# EAGLE board 31813A (EAGLE 7.5.0)
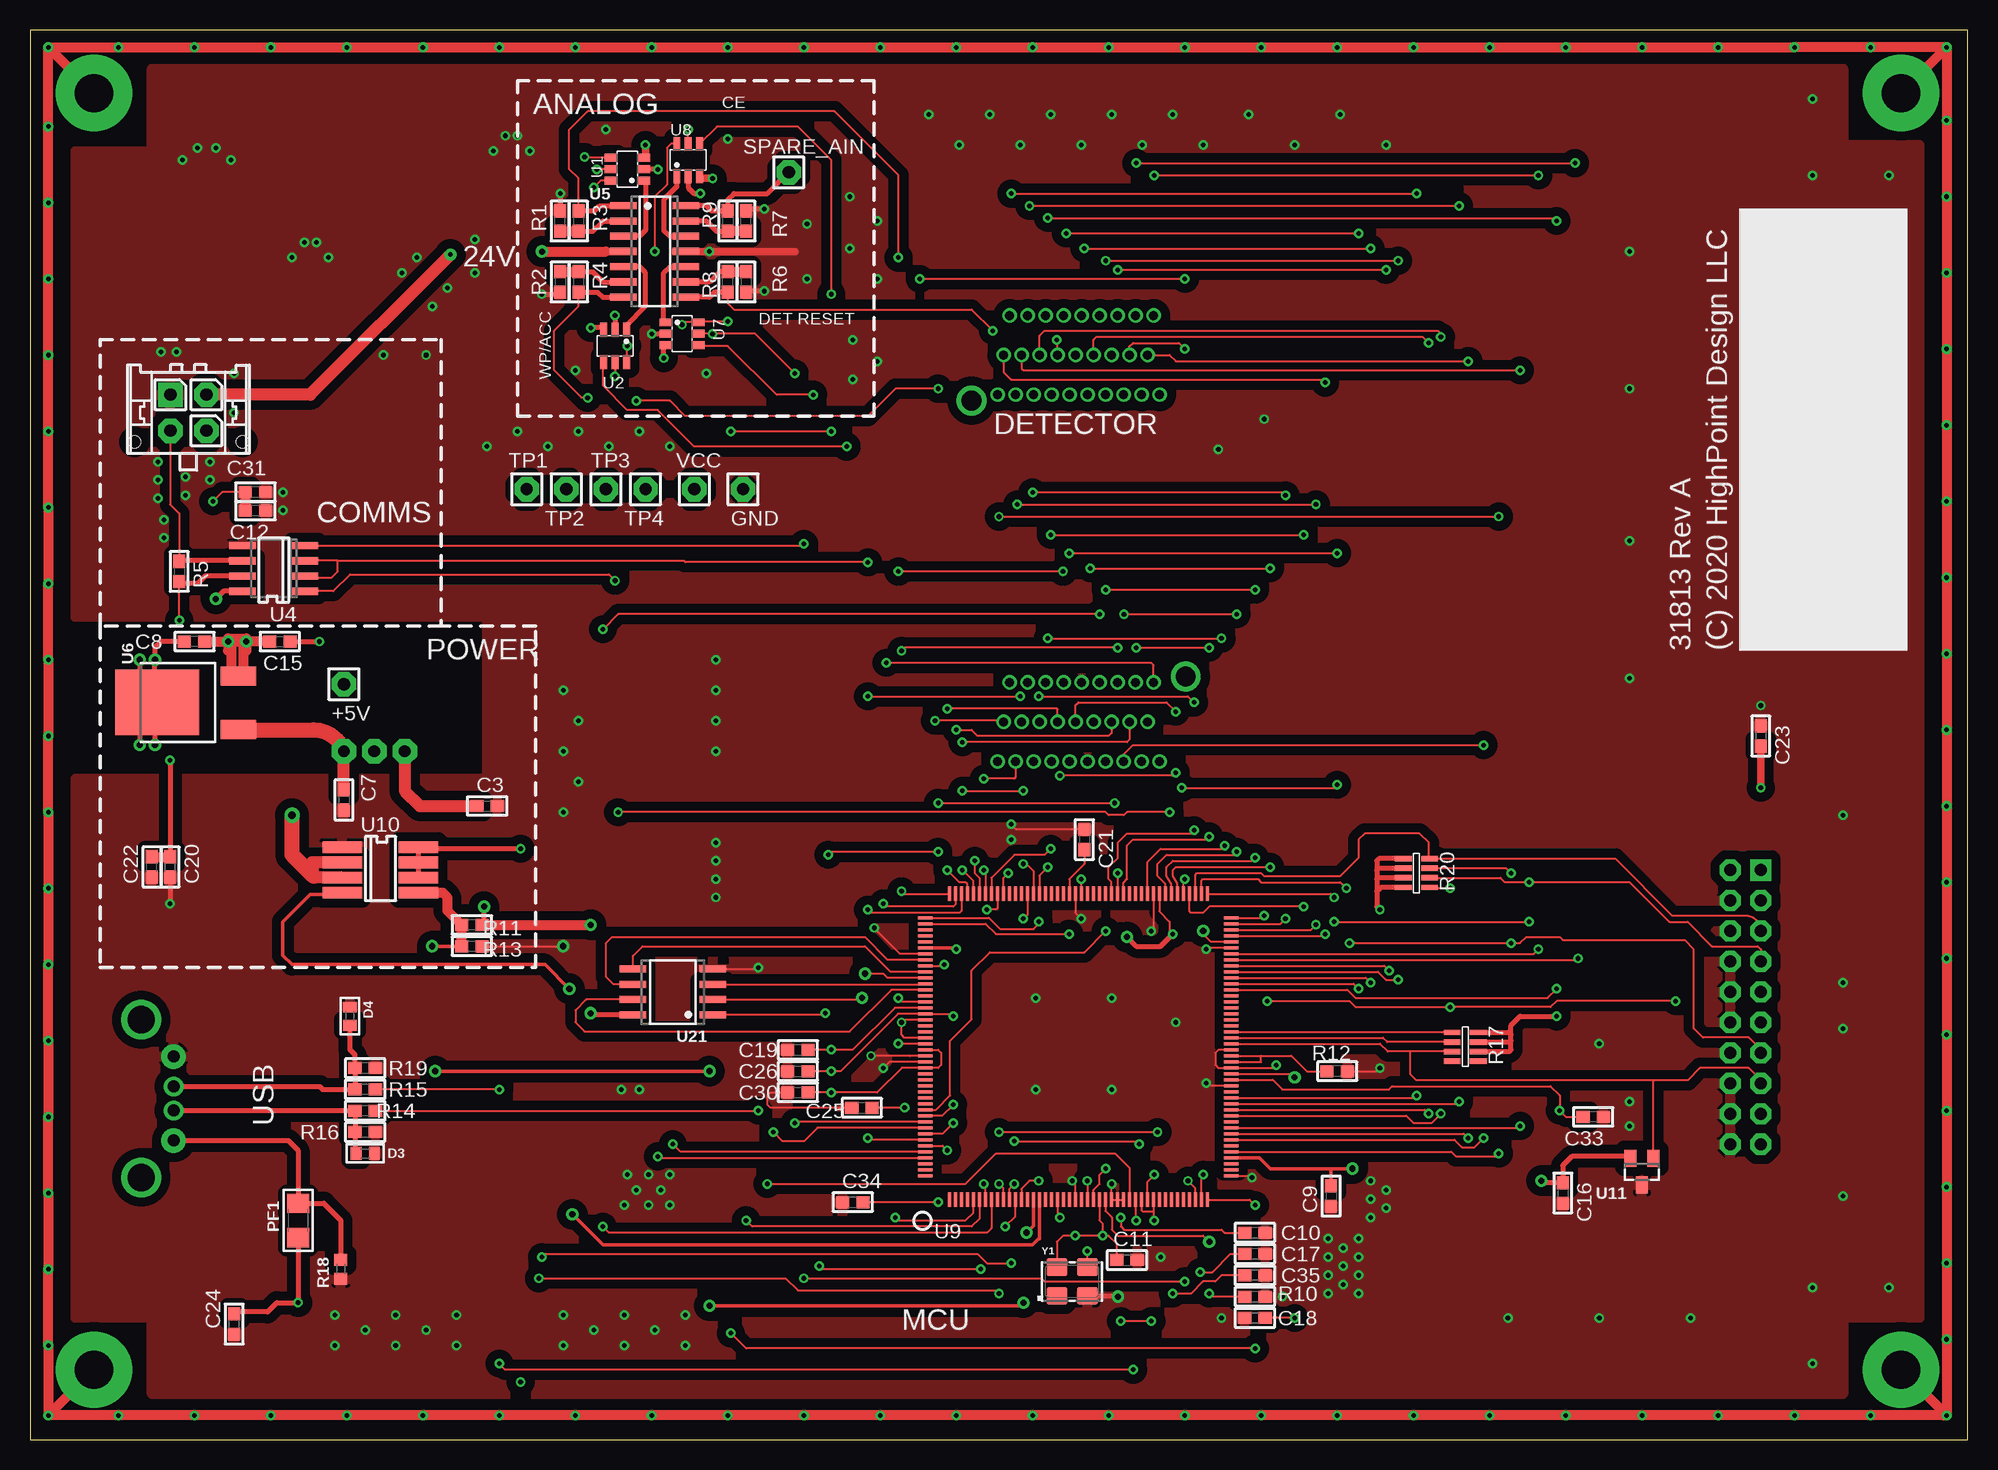
[diagram p2: board, top side]
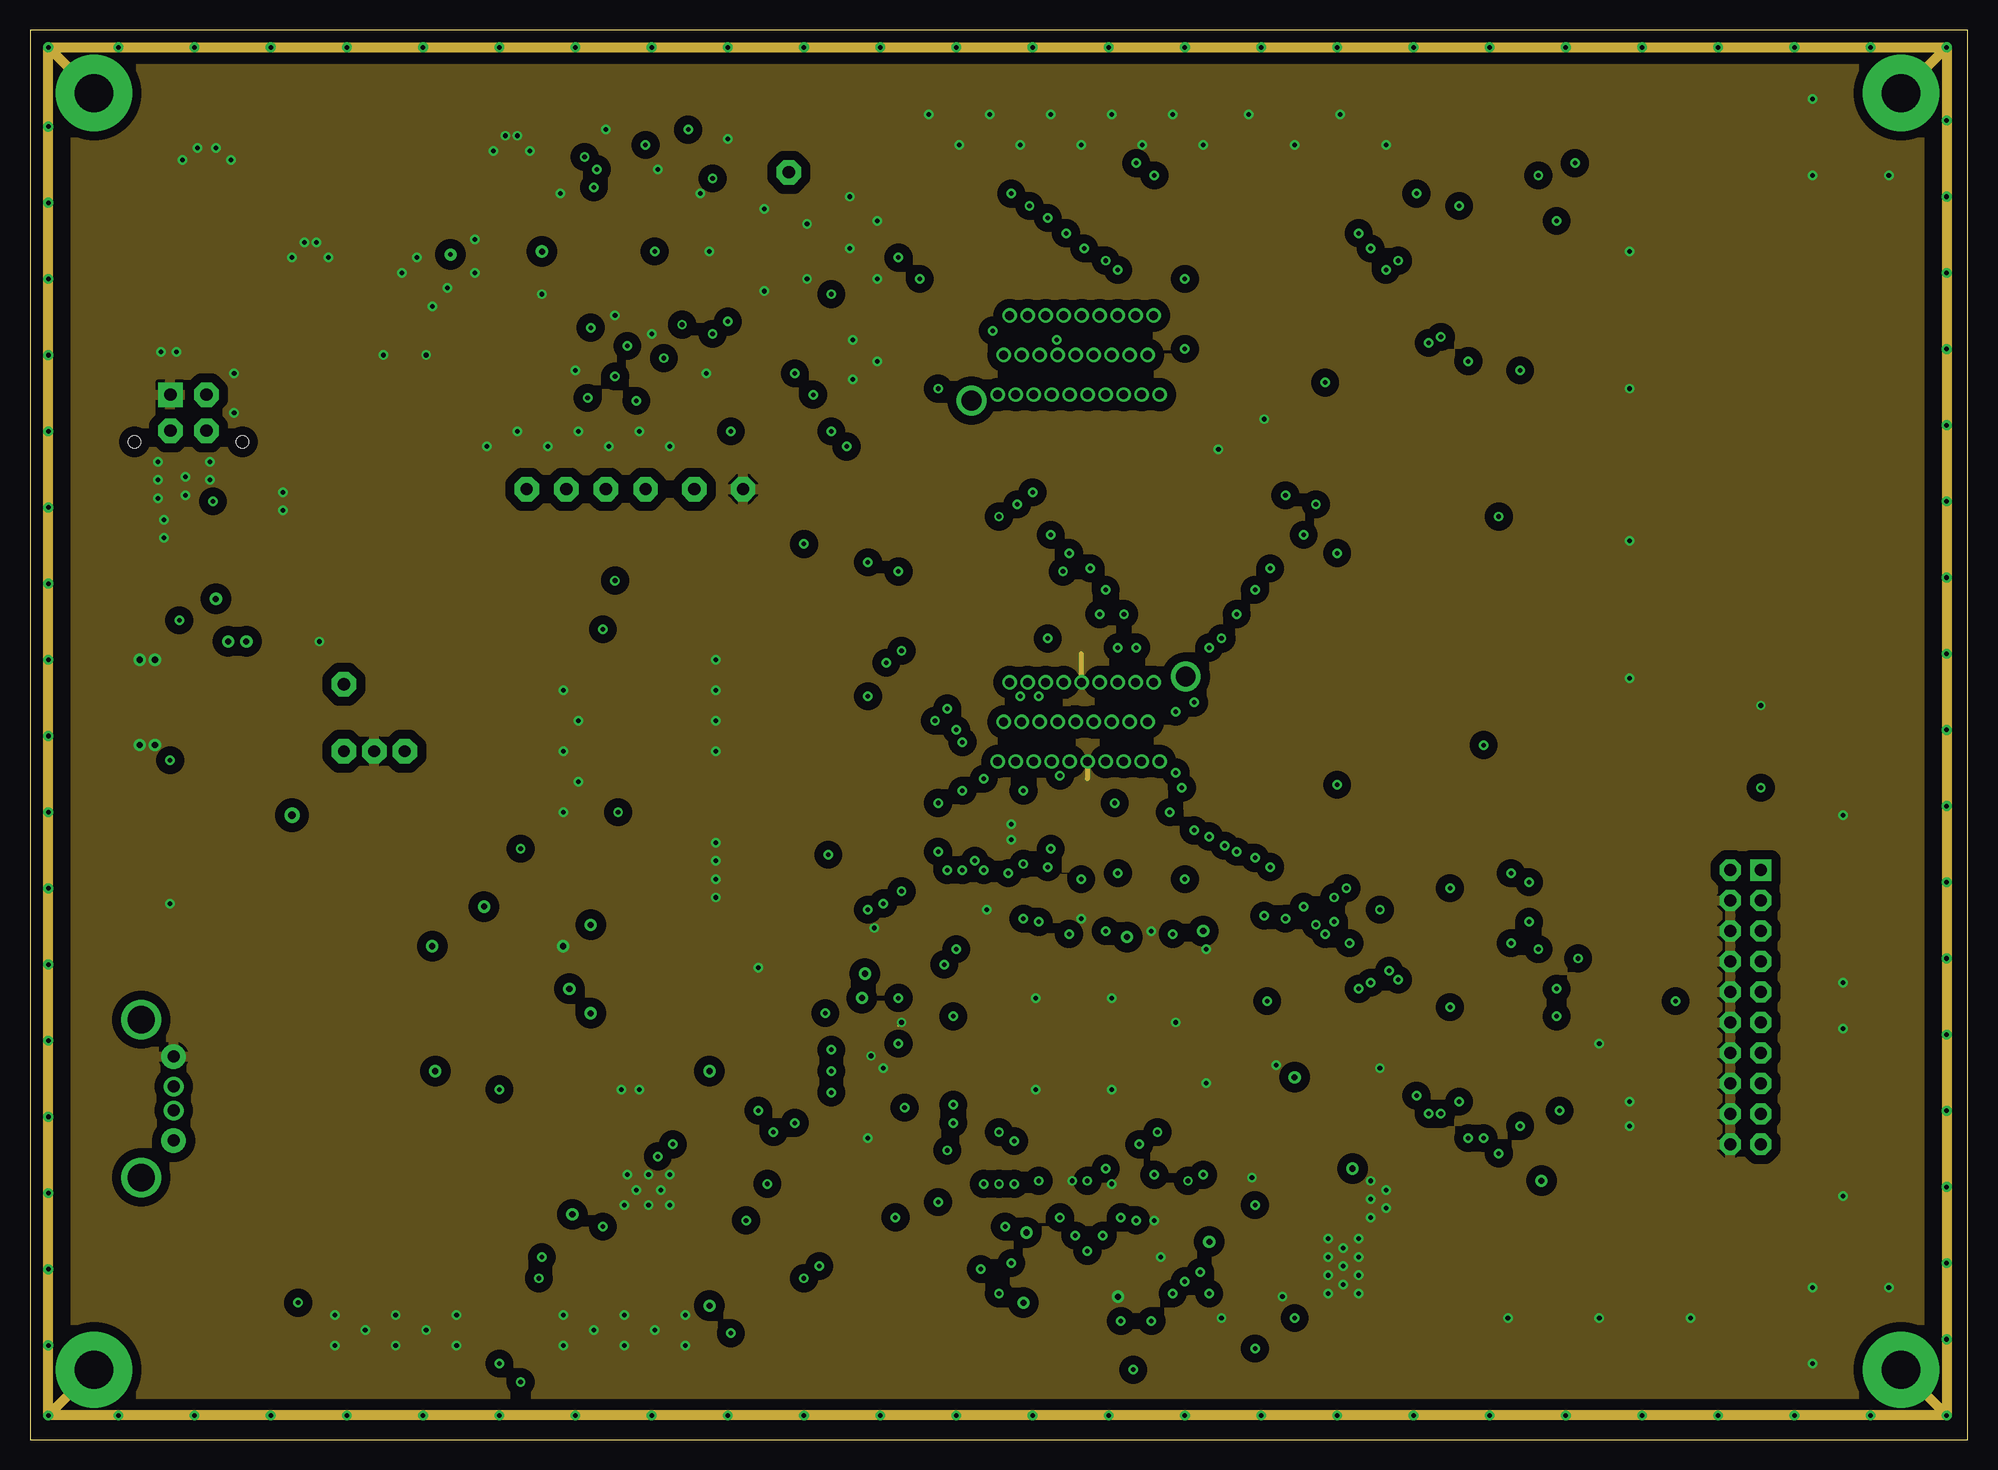
[diagram p3: board, inner layer Route2]
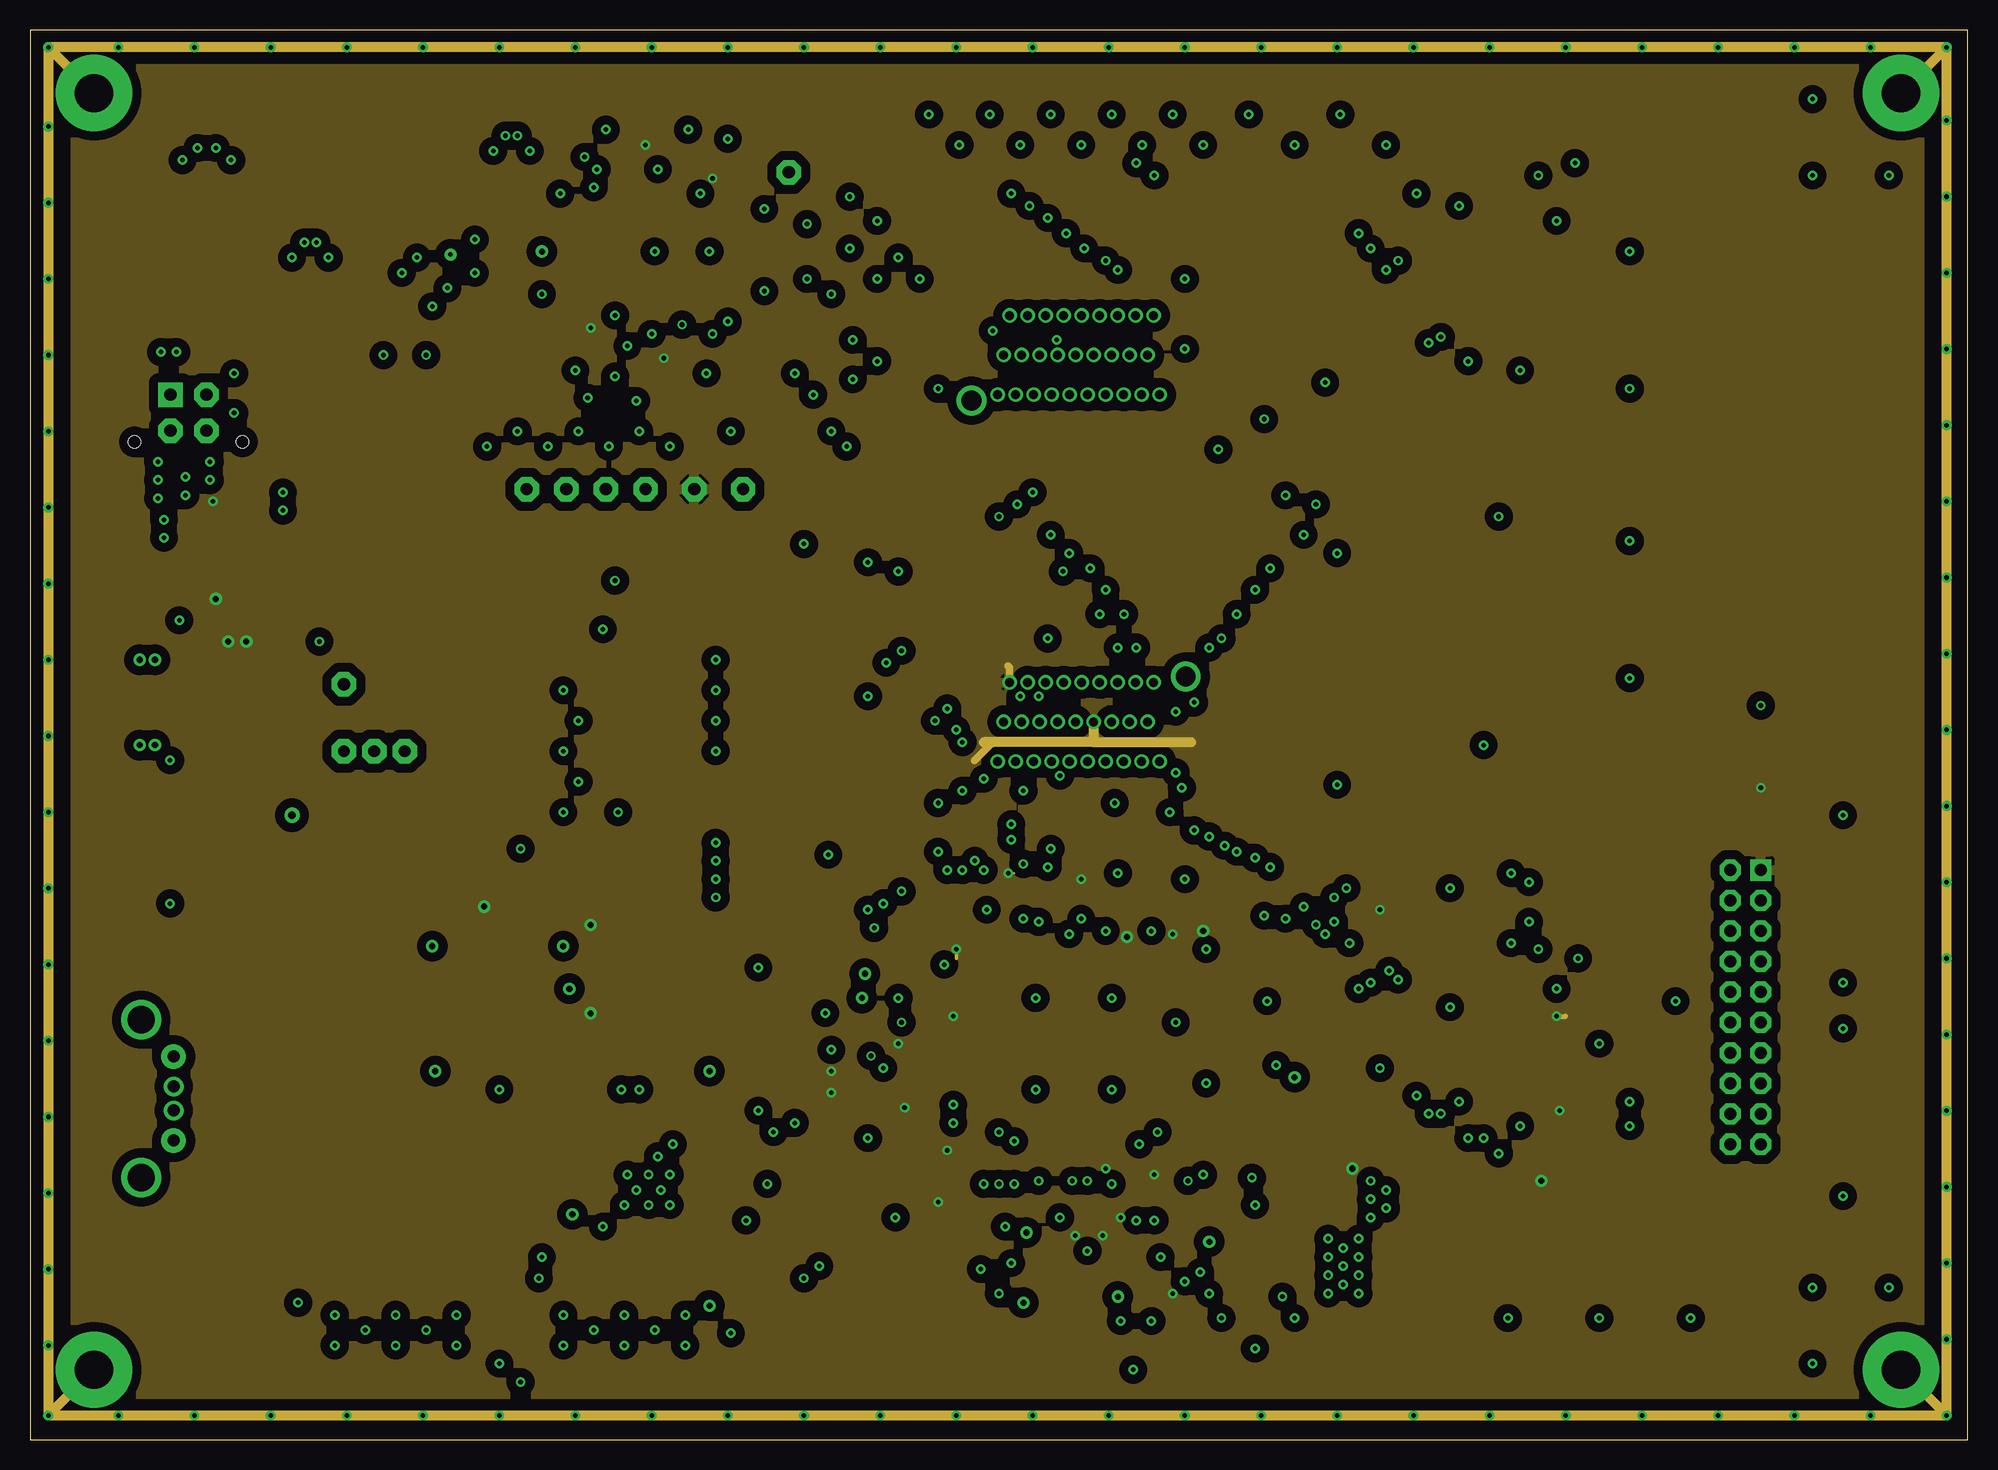
[diagram p4: board, inner layer Route15]
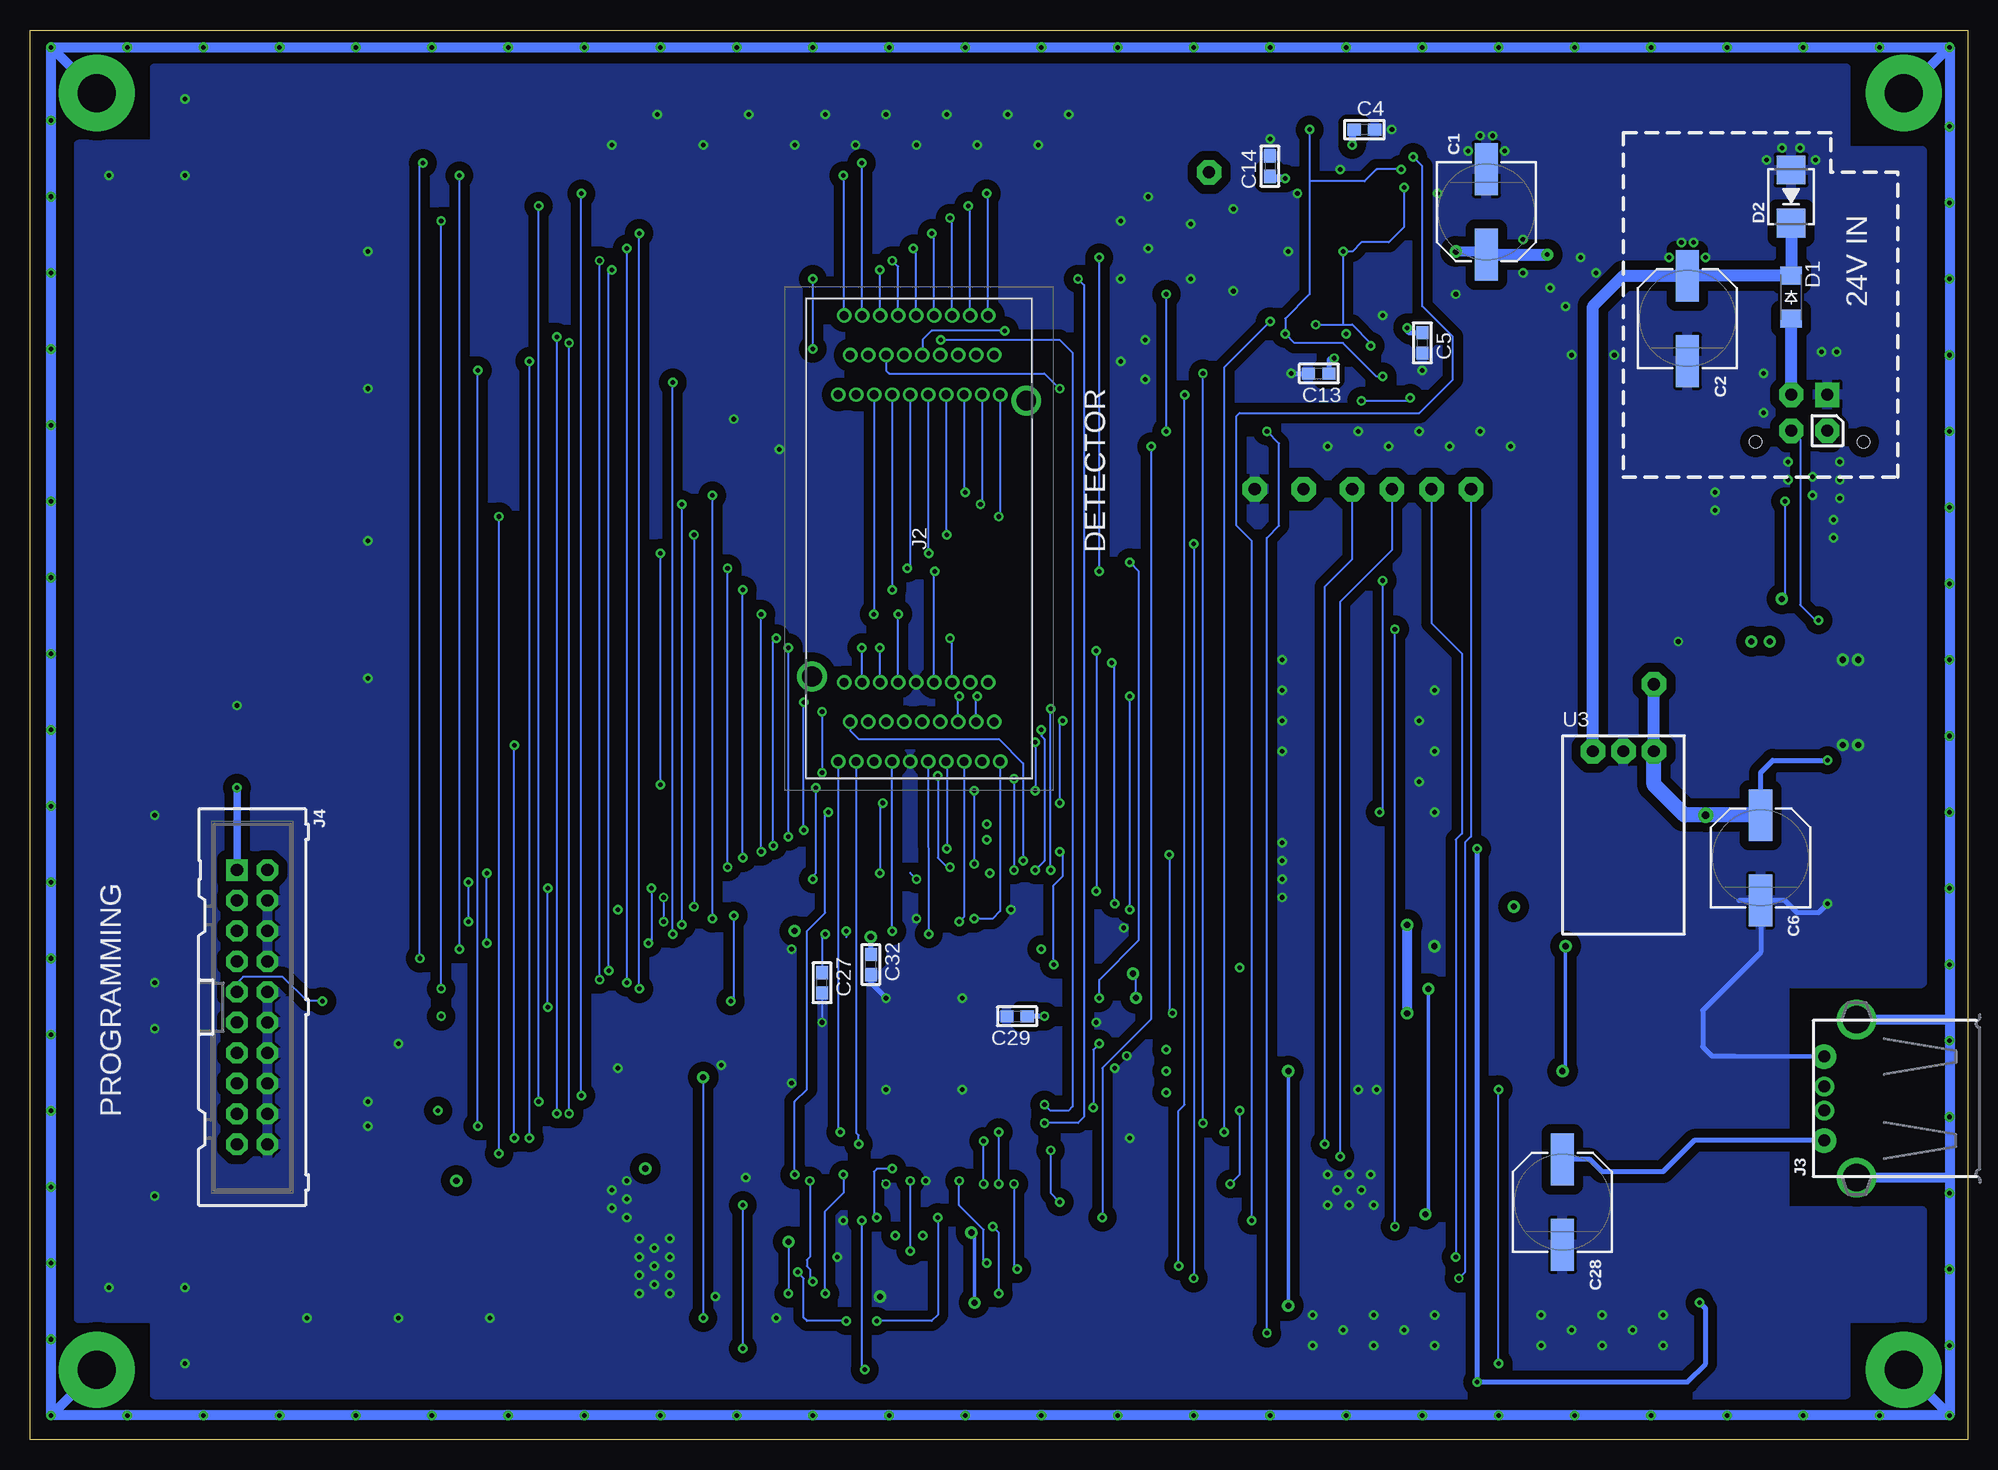
[diagram p5: board, bottom side, seen from below]

Size 161.52 x 117.53 mm. Coordinates in mm from the lower left corner, seen from the top.
Outline: 0,0 161.52,0 161.52,117.53 0,117.53 0,0
Copper layers (1*2+15*16): Top 0.035559375mm / dielectric 0.50038125mm / Route2 0.035559375mm / dielectric 0.50038125mm / Route15 0.035559375mm / dielectric 0.50038125mm / Bottom 0.035559375mm
Design rules "HPT 7X7 4 Layer": minimum track width 6mil, minimum drill 13mil, track to track 6mil, track to pad 6mil, pad to pad 6mil, via to via 6mil, smd to smd 6mil, copper to edge 24mil, drill to drill 15mil, minimum pad ring 0mil, minimum via ring 8mil, stop-mask expansion 4mil, vias tented up to drill 16mil, thermal gap 10mil

## Footprints (pad centres in the part's own frame; a part is rotated, then mirrored left to right if it is on the bottom)
TP8040 = drill 1.016 pad 2.032 octagon: 1 0,0
CSV-E/F = smd 4.318 x 1.93: + -3.556,0; - 3.556,0
0603 = smd 1.1 x 1: 1 -0.85,0; 2 0.85,0
SOD-123_MINI-SMA = smd 1.5 x 1.8: A 1.8,0; C -1.8,0
SMB = smd 2.4 x 2.4: A 2.223,0; C -2.223,0
PGB-0603 = smd 0.9 x 1.1: 1 -0.762,0; 2 0.762,0
43045-0412 = drill 1.02 pad 2.032 square: 1 1.5,0 | drill 1.02 pad 2.032 octagon: 2 -1.5,0; 3 1.5,3; 4 -1.5,3 | hole 1.02: 4.5,3.94; -4.5,3.94
IC1910562003 = drill 0.75 pad 1.2: 1 0,0; 2 0,-1.5; 3 0,-3; 4 0,-4.5; 5 0,-6; 6 0,-7.5; 7 0,-9; 8 0,-10.5; 9 0,-12; 10 3.3,0.5; 11 3.3,-1; 12 3.3,-2.5; 13 3.3,-4; 14 3.3,-5.5; 15 3.3,-7; 16 3.3,-8.5; 17 3.3,-10; 18 3.3,-11.5; 19 6.6,1; 20 6.6,-0.5; 21 6.6,-2; 22 6.6,-3.5; 23 6.6,-5; 24 6.6,-6.5; 25 6.6,-8; 26 6.6,-9.5; 27 6.6,-11; 28 6.6,-12.5; 29 30.58,0; 30 30.58,-1.5; 31 30.58,-3; 32 30.58,-4.5; 33 30.58,-6; 34 30.58,-7.5; 35 30.58,-9; 36 30.58,-10.5; 37 30.58,-12; 38 33.88,0.5; 39 33.88,-1; 40 33.88,-2.5; 41 33.88,-4; 42 33.88,-5.5; 43 33.88,-7; 44 33.88,-8.5; 45 33.88,-10; 46 33.88,-11.5; 47 37.18,1; 48 37.18,-0.5; 49 37.18,-2; 50 37.18,-3.5; 51 37.18,-5; 52 37.18,-6.5; 53 37.18,-8; 54 37.18,-9.5; 55 37.18,-11; 56 37.18,-12.5 | drill 1.65 pad 2.475: MH1 7.09,3.175; MH2 30.09,-14.675
USB = drill 1 pad 2.032: 1 -3.5,12.99; 4 3.5,12.99 | drill 1 pad 1.651: 2 -1,12.99; 3 1,12.99 | drill 2.286 pad 3.302: S1 -6.579,10.287; S2 6.579,10.287
ML20 = drill 1.016 pad 1.778 square: 1 -11.43,-1.27 | drill 1.016 pad 1.778 octagon: 2 -11.43,1.27; 3 -8.89,-1.27; 4 -8.89,1.27; 5 -6.35,-1.27; 6 -6.35,1.27; 7 -3.81,-1.27; 8 -3.81,1.27; 9 -1.27,-1.27; 10 -1.27,1.27; 11 1.27,-1.27; 12 1.27,1.27; 13 3.81,-1.27; 14 3.81,1.27; 15 6.35,-1.27; 16 6.35,1.27; 17 8.89,-1.27; 18 8.89,1.27; 19 11.43,-1.27; 20 11.43,1.27
MNT-125 = drill 3.175 pad 6.35: 1 0,0
F1206 = smd 1.6 x 1.803: 1 -1.429,0; 2 1.429,0
RNET-4R-38V = smd 0.45 x 1.4: 1 -1.2,-1.1; 2 -0.4,-1.1; 3 0.4,-1.1; 4 1.2,-1.1; 5 1.2,1.1; 6 0.4,1.1; 7 -0.4,1.1; 8 -1.2,1.1
R0603 = smd 1 x 1.1: 1 -0.794,0; 2 0.794,0
SOT23-6 = smd 0.6 x 1.1: 1 -0.95,-1.35; 2 0,-1.35; 3 0.95,-1.35; 4 0.95,1.35; 5 0,1.35; 6 -0.95,1.35
PS-OKI-78SR = drill 0.991 pad 2.032 octagon: 1 -2.54,0; 2 0,0; 3 2.54,0
SOIC-08-150 = smd 0.6 x 2.2: 1 -1.905,-2.6; 2 -0.635,-2.6; 3 0.635,-2.6; 4 1.905,-2.6; 5 1.905,2.6; 6 0.635,2.6; 7 -0.635,2.6; 8 -1.905,2.6
SO14 = smd 0.6 x 2.2: 1 -3.81,-2.6; 2 -2.54,-2.6; 3 -1.27,-2.6; 4 0,-2.6; 5 1.27,-2.6; 6 2.54,-2.6; 7 3.81,-2.6; 8 3.81,2.6; 9 2.54,2.6; 10 1.27,2.6; 11 0,2.6; 12 -1.27,2.6; 13 -2.54,2.6; 14 -3.81,2.6
DPAK = smd 1.6 x 2.997: 1 -2.261,-4.928; 3 2.21,-4.928 | smd 5.452 x 7: 4 0,1.853
LQFP176 = smd 0.25 x 1.2: 1 -10.75,-12.75; 2 -10.25,-12.75; 3 -9.75,-12.75; 4 -9.25,-12.75; 5 -8.75,-12.75; 6 -8.25,-12.75; 7 -7.75,-12.75; 8 -7.25,-12.75; 9 -6.75,-12.75; 10 -6.25,-12.75; 11 -5.75,-12.75; 12 -5.25,-12.75; 13 -4.75,-12.75; 14 -4.25,-12.75; 15 -3.75,-12.75; 16 -3.25,-12.75; 17 -2.75,-12.75; 18 -2.25,-12.75; 19 -1.75,-12.75; 20 -1.25,-12.75; 21 -0.75,-12.75; 22 -0.25,-12.75; 23 0.25,-12.75; 24 0.75,-12.75; 25 1.25,-12.75; 26 1.75,-12.75; 27 2.25,-12.75; 28 2.75,-12.75; 29 3.25,-12.75; 30 3.75,-12.75; 31 4.25,-12.75; 32 4.75,-12.75; 33 5.25,-12.75; 34 5.75,-12.75; 35 6.25,-12.75; 36 6.75,-12.75; 37 7.25,-12.75; 38 7.75,-12.75; 39 8.25,-12.75; 40 8.75,-12.75; 41 9.25,-12.75; 42 9.75,-12.75; 43 10.25,-12.75; 44 10.75,-12.75; 89 10.75,12.75; 90 10.25,12.75; 91 9.75,12.75; 92 9.25,12.75; 93 8.75,12.75; 94 8.25,12.75; 95 7.75,12.75; 96 7.25,12.75; 97 6.75,12.75; 98 6.25,12.75; 99 5.75,12.75; 100 5.25,12.75; 101 4.75,12.75; 102 4.25,12.75; 103 3.75,12.75; 104 3.25,12.75; 105 2.75,12.75; 106 2.25,12.75; 107 1.75,12.75; 108 1.25,12.75; 109 0.75,12.75; 110 0.25,12.75; 111 -0.25,12.75; 112 -0.75,12.75; 113 -1.25,12.75; 114 -1.75,12.75; 115 -2.25,12.75; 116 -2.75,12.75; 117 -3.25,12.75; 118 -3.75,12.75; 119 -4.25,12.75; 120 -4.75,12.75; 121 -5.25,12.75; 122 -5.75,12.75; 123 -6.25,12.75; 124 -6.75,12.75; 125 -7.25,12.75; 126 -7.75,12.75; 127 -8.25,12.75; 128 -8.75,12.75; 129 -9.25,12.75; 130 -9.75,12.75; 131 -10.25,12.75; 132 -10.75,12.75 | smd 1.2 x 0.25: 45 12.75,-10.75; 46 12.75,-10.25; 47 12.75,-9.75; 48 12.75,-9.25; 49 12.75,-8.75; 50 12.75,-8.25; 51 12.75,-7.75; 52 12.75,-7.25; 53 12.75,-6.75; 54 12.75,-6.25; 55 12.75,-5.75; 56 12.75,-5.25; 57 12.75,-4.75; 58 12.75,-4.25; 59 12.75,-3.75; 60 12.75,-3.25; 61 12.75,-2.75; 62 12.75,-2.25; 63 12.75,-1.75; 64 12.75,-1.25; 65 12.75,-0.75; 66 12.75,-0.25; 67 12.75,0.25; 68 12.75,0.75; 69 12.75,1.25; 70 12.75,1.75; 71 12.75,2.25; 72 12.75,2.75; 73 12.75,3.25; 74 12.75,3.75; 75 12.75,4.25; 76 12.75,4.75; 77 12.75,5.25; 78 12.75,5.75; 79 12.75,6.25; 80 12.75,6.75; 81 12.75,7.25; 82 12.75,7.75; 83 12.75,8.25; 84 12.75,8.75; 85 12.75,9.25; 86 12.75,9.75; 87 12.75,10.25; 88 12.75,10.75; 133 -12.75,10.75; 134 -12.75,10.25; 135 -12.75,9.75; 136 -12.75,9.25; 137 -12.75,8.75; 138 -12.75,8.25; 139 -12.75,7.75; 140 -12.75,7.25; 141 -12.75,6.75; 142 -12.75,6.25; 143 -12.75,5.75; 144 -12.75,5.25; 145 -12.75,4.75; 146 -12.75,4.25; 147 -12.75,3.75; 148 -12.75,3.25; 149 -12.75,2.75; 150 -12.75,2.25; 151 -12.75,1.75; 152 -12.75,1.25; 153 -12.75,0.75; 154 -12.75,0.25; 155 -12.75,-0.25; 156 -12.75,-0.75; 157 -12.75,-1.25; 158 -12.75,-1.75; 159 -12.75,-2.25; 160 -12.75,-2.75; 161 -12.75,-3.25; 162 -12.75,-3.75; 163 -12.75,-4.25; 164 -12.75,-4.75; 165 -12.75,-5.25; 166 -12.75,-5.75; 167 -12.75,-6.25; 168 -12.75,-6.75; 169 -12.75,-7.25; 170 -12.75,-7.75; 171 -12.75,-8.25; 172 -12.75,-8.75; 173 -12.75,-9.25; 174 -12.75,-9.75; 175 -12.75,-10.25; 176 -12.75,-10.75
SOIC-8-SPECIAL = smd 0.965 x 3.302: 1 -1.905,-3.175; 2 -0.635,-3.175; 3 0.635,-3.175; 4 1.905,-3.175; 5 1.905,3.175; 6 0.635,3.175; 7 -0.635,3.175; 8 -1.905,3.175
SOT23 = smd 1 x 1.4: 1 -0.95,-1.1; 2 0.95,-1.1; 3 0,1.1
SO08-JB = smd 0.6 x 2.2: 1 -1.905,-3.33; 2 -0.635,-3.33; 3 0.635,-3.33; 4 1.905,-3.33; 5 1.905,3.33; 6 0.635,3.33; 7 -0.635,3.33; 8 -1.905,3.33
ASFL1 = smd 1.7 x 1.5: 1 -1.27,-1.2; 2 1.27,-1.2; 3 1.27,1.2; 4 -1.27,1.2

## Placement (x,y rotation side)
+5V  TP  [TP8040]  26.16,62.99 0 top
C1  100 Uf  [CSV-E/F]  40.13,102.36 90 bottom
C2  100 Uf  [CSV-E/F]  23.37,93.47 270 bottom
C3  0.1 uF  [0603]  38.1,52.83 0 top
C4  10 uF  [0603]  50.29,109.22 180 bottom
C5  10 uF  [0603]  45.47,91.44 90 bottom
C6  100 Uf  [CSV-E/F]  17.27,48.51 270 bottom
C7  0.1 uF  [0603]  26.16,53.34 270 top
C8  10 uF  [0603]  13.72,66.55 180 top
C9  10 uF  [0603]  108.46,20.32 270 top
C10  10 uF  [0603]  102.11,17.27 0 top
C11  10 uF  [0603]  91.44,14.99 0 top
C12  0.1 uF  [0603]  18.8,77.47 0 top
C13  10 uF  [0603]  54.1,88.9 0 bottom
C14  10 uF  [0603]  58.17,106.17 270 bottom
C15  0.1 uF  [0603]  20.83,66.55 0 top
C16  0.1 uF  [0603]  127.76,20.57 270 top
C17  10 uF  [0603]  102.11,15.49 180 top
C18  0.1 uF  [0603]  102.11,10.16 0 top
C19  0.1 uF  [0603]  64.01,32.51 0 top
C20  10 uF  [0603]  11.68,47.75 90 top
C21  10 uF  [0603]  87.88,50.04 270 top
C22  10 uF  [0603]  10.16,47.75 90 top
C23  0.1 uF  [0603]  144.27,58.67 270 top
C24  0.1 uF  [0603]  17.02,9.65 90 top
C25  10 uF  [0603]  69.34,27.69 0 top
C26  10 uF  [0603]  64.01,30.73 0 top
C27  0.1 uF  [0603]  95.5,38.1 90 bottom
C28  100 uF  [CSV-E/F]  33.78,19.81 270 bottom
C29  10 uF  [0603]  79.25,35.31 0 bottom
C30  10 uF  [0603]  64.01,28.96 0 top
C31  0.1 uF  [0603]  18.8,78.99 180 top
C32  0.1 uF  [0603]  91.44,39.62 90 bottom
C33  10 uF  [0603]  130.3,26.92 180 top
C34  10 uF  [0603]  68.58,19.81 0 top
C35  0.1 uF  [0603]  102.11,13.72 180 top
D1  DIODE  [SOD-123_MINI-SMA]  14.73,95.25 270 bottom
D2  36 V  [SMB]  14.73,103.63 90 bottom
D3  PGB-0603  [PGB-0603]  27.94,23.88 180 top
D4  PGB-0603  [PGB-0603]  26.67,35.31 270 top
GND  TP  [TP8040]  59.44,79.25 0 top
J1  [43045-0412]  13.21,87.12 180 top
J2  IC191-0562-003  [IC1910562003]  81.66,93.73 270 bottom
J3  [USB]  -1.02,28.45 90 bottom
J4  [ML20]  143,36.07 270 bottom
M1  MNT-125  [MNT-125]  5.33,5.84 0 top
M2  MNT-125  [MNT-125]  155.96,112.27 0 top
M3  MNT-125  [MNT-125]  5.33,112.27 0 top
M4  MNT-125  [MNT-125]  155.96,5.84 0 top
PF1  0.5 A  [F1206]  22.35,18.29 90 top
R1  2.2K  [0603]  44.2,101.6 90 top
R2  2.2K  [0603]  44.2,96.52 270 top
R3  10K  [0603]  45.72,101.6 270 top
R4  10K  [0603]  45.72,96.52 270 top
R5  120  [0603]  12.45,72.39 270 top
R6  2.2K  [0603]  59.69,96.52 270 top
R7  2.2K  [0603]  59.69,101.6 90 top
R8  10K  [0603]  58.17,96.52 90 top
R9  10K  [0603]  58.17,101.6 270 top
R10  2.2 K 1%  [0603]  102.11,11.94 0 top
R11  47 K  [0603]  36.83,42.93 180 top
R12  10 K  [0603]  108.97,30.73 180 top
R13  47 K  [0603]  36.83,41.15 180 top
R14  22.1  [0603]  27.94,27.43 180 top
R15  22.1  [0603]  27.94,29.21 180 top
R16  15 K  [0603]  27.94,25.65 180 top
R17  4.7 K  [RNET-4R-38V]  119.63,32.77 90 top
R18  MOV 12V  [R0603]  25.91,14.22 270 top
R19  15 K  [0603]  27.94,30.99 180 top
R20  4.7 K  [RNET-4R-38V]  115.57,47.24 90 top
SPARE_AIN  TP  [TP8040]  63.25,105.66 0 top
TP1  TP  [TP8040]  41.4,79.25 0 top
TP2  TP  [TP8040]  44.7,79.25 0 top
TP3  TP  [TP8040]  48.01,79.25 0 top
TP4  TP  [TP8040]  51.31,79.25 0 top
U1  DAC121  [SOT23-6]  49.78,105.92 90 top
U2  DAC121  [SOT23-6]  48.77,91.19 180 top
U3  OKI-78SR-5  [PS-OKI-78SR]  28.7,57.4 0 bottom
U4  SN65HVD12D  [SOIC-08-150]  20.32,72.64 90 top
U5  TLV9304IDR  [SO14]  52.07,99.06 270 top
U6  LD29080T  [DPAK]  12.45,61.47 90 top
U7  DAC121  [SOT23-6]  54.36,92.2 270 top
U8  DAC121  [SOT23-6]  54.86,106.68 0 top
U9  S7G2  [LQFP176]  87.38,32.77 0 top
U10  TPS2051  [SOIC-8-SPECIAL]  29.21,47.5 270 top
U11  MCP120  [SOT23]  134.37,22.35 180 top
U21  W25Q128FV  [SO08-JB]  53.59,37.34 90 top
VCC  TP  [TP8040]  55.37,79.25 0 top
Y1  24.000 MHz  [ASFL1]  86.87,13.21 0 top

## Tracks (layer width: path | path; a pad name or v marks a point on that pad's centre or on a via)
+5V  (via drill 0.38, 0.64 pad 1.27)
  Top 0.406: v11.68,56.64 C20.2
  Top 0.813: C22.2 C20.2
  Top 1.016: U10.2 23.5,48.13 23.62,48.01 23.62,46.99 23.75,46.86 U10.3 | C7.1 U3.3
  Top 1.27: U6.1 17.4,59.18 23.62,59.18 arc-70 U3.3 | 23.62,46.99 21.84,48.77 v21.84,52.07
  Bottom 0.406: C6.+ 17.27,55.63 16.26,56.64 v11.68,56.64
  Bottom 1.016: U3.3 +5V.1
  Bottom 1.27: C6.+ v21.84,52.07 23.62,52.07 26.16,54.61 U3.3
+24V  (via drill 0.38 pad 1.02, 0.51 pad 1.02)
  Top 0.61: 48.01,99.06 U5.4
  Top 0.813: v42.67,99.06 48.01,99.06
  Top 1.016: v35.05,98.81 23.37,87.12 J1.2
  Bottom 0.813: C1.+ 40.39,99.06 v42.67,99.06
  Bottom 1.016: J1.2 14.73,87.15 D1.A | C1.+ v35.05,98.81
A_00  (via drill 0.38 pad 0.76)
  Top 0.178: v84.84,66.8 v99.31,66.8 | U9.99 93.13,48.17 94.23,49.28 99.31,49.28 v99.57,49.53
  Bottom 0.178: J2.31 84.66,66.63 v84.84,66.8 | v99.57,49.53 99.57,66.55 v99.31,66.8
A_01  (via drill 0.38 pad 0.76)
  Top 0.178: v91.19,68.83 v100.58,68.83 | U9.96 94.63,46.34 93.98,46.99 93.98,48.01 94.74,48.77 100.33,48.77 v100.58,49.02
  Bottom 0.178: J2.26 91.16,68.86 v91.19,68.83 | v100.58,49.02 v100.58,68.83
A_02  (via drill 0.38 pad 0.76)
  Top 0.178: v89.66,70.87 v102.11,70.87 | U9.95 95.13,46.35 94.74,46.99 94.74,47.75 95.25,48.26 101.85,48.26 v102.11,48.51
  Bottom 0.178: J2.25 v89.66,70.87 | v102.11,48.51 v102.11,70.87
A_03  (via drill 0.38 pad 0.76)
  Top 0.178: v88.39,72.64 v103.38,72.64 | U9.94 95.63,46.36 95.25,46.99 95.25,47.5 95.5,47.75 v103.38,47.75
  Bottom 0.178: J2.24 88.16,72.88 v88.39,72.64 | v103.38,47.75 v103.38,72.64
A_04  (via drill 0.38 pad 0.76)
  Top 0.178: v86.61,73.91 v108.97,73.91 | v96.01,54.36 108.71,54.36 v108.97,54.61 | U9.93 96.13,46.6 v96.27,46.74
  Bottom 0.178: J2.23 86.66,73.96 v86.61,73.91 | v96.01,54.36 96.01,47.24 96.27,46.99 v96.27,46.74 | v108.97,54.61 v108.97,73.91
A_05  (via drill 0.38 pad 0.76)
  Top 0.178: v85.09,75.44 v106.17,75.44 | v106.17,44.45 98.3,44.45 97.79,43.94 96.77,43.94 96.63,44.09 U9.92
  Bottom 0.178: J2.22 85.16,75.51 v85.09,75.44 | v106.17,75.44 v106.17,44.45
A_06  (via drill 0.38 pad 0.76)
  Top 0.178: v83.57,78.99 104.39,78.99 v104.65,78.74 | U9.87 104.23,43.02 v104.65,43.43
  Bottom 0.178: J2.21 83.66,79.09 v83.57,78.99 | v104.65,43.43 v104.65,78.74
A_07  (via drill 0.38 pad 0.76)
  Top 0.178: v82.3,77.98 v107.19,77.98 | U9.86 106.78,42.52 v107.19,42.93
  Bottom 0.178: J2.20 82.16,78.11 v82.3,77.98 | v107.19,42.93 v107.19,77.98
A_08  (via drill 0.38 pad 0.76)
  Top 0.178: J2.10 81.16,89.02 81.79,88.39 107.7,88.39 v107.95,88.14 | U9.85 107.8,42.02 v107.95,42.16
  Bottom 0.178: v107.95,42.16 v107.95,88.14
A_09  (via drill 0.38 pad 0.76)
  Top 0.178: v93.73,105.41 v125.73,105.41 | U9.82 125.35,40.52 v125.73,40.89
  Bottom 0.178: J2.9 93.66,105.34 v93.73,105.41 | v125.73,40.89 v125.73,105.41
A_10  (via drill 0.38 pad 0.76)
  Top 0.178: v92.2,106.43 v128.78,106.43 | U9.81 128.92,40.02 v129.03,40.13
  Bottom 0.178: J2.8 92.16,106.39 v92.2,106.43 | v129.03,40.13 129.03,106.17 v128.78,106.43
A_11  (via drill 0.38 pad 0.76)
  Top 0.178: v90.68,97.54 v113.03,97.54 | U9.80 112.88,39.52 v113.28,39.12
  Bottom 0.178: J2.7 90.66,97.52 v90.68,97.54 | v113.28,39.12 113.28,97.28 v113.03,97.54
A_12  (via drill 0.38 pad 0.76)
  Top 0.178: v89.66,98.3 v114.05,98.3 | U9.79 112.37,39.02 113.03,38.35 v114.05,38.35
  Bottom 0.178: J2.6 89.16,97.8 v89.66,98.3 | v114.05,38.35 v114.05,98.3
A_13  (via drill 0.38 pad 0.76)
  Top 0.178: v87.88,99.31 v111.76,99.31 | U9.78 111.34,38.52 v111.76,38.1
  Bottom 0.178: J2.5 87.66,99.09 v87.88,99.31 | v111.76,38.1 v111.76,99.31
A_14  (via drill 0.38 pad 0.76)
  Top 0.178: v86.36,100.58 v110.74,100.58 | U9.77 110.32,38.02 v110.74,37.59
  Bottom 0.178: J2.4 86.16,100.39 v86.36,100.58 | v110.74,37.59 v110.74,100.58
A_15  (via drill 0.38 pad 0.76)
  Top 0.178: v84.84,101.85 127,101.85 v127.25,101.6 | 127.18,37.52 v127.25,37.59 126.49,36.83 110.49,36.83 109.8,37.52 U9.76
  Bottom 0.178: J2.3 84.66,101.68 v84.84,101.85 | v127.25,37.59 v127.25,101.6
A_16  (via drill 0.38 pad 0.76)
  Top 0.178: J2.54 91.16,57.12 91.95,57.91 v121.16,57.91 | U9.51 118.74,25.02 119.37,24.38 120.4,24.38 v121.16,25.15
  Bottom 0.178: v121.16,25.15 v121.16,57.91
A_17  (via drill 0.38 pad 0.76)
  Top 0.178: v80.77,76.96 v122.43,76.96 | U9.49 118.48,24.02 118.87,23.62 122.17,23.62 v122.43,23.88
  Bottom 0.178: J2.19 80.66,77.07 v80.77,76.96 | v122.43,23.88 v122.43,76.96
A_18  (via drill 0.38 pad 0.76)
  Top 0.178: J2.18 94.99,90.43 95.5,89.92 v119.89,89.92 | U9.52 119.52,25.52 v119.89,25.15
  Bottom 0.178: v119.89,25.15 v119.89,89.92
A_19  (via drill 0.38 pad 0.76)
  Top 0.178: J2.11 82.66,89.3 82.8,89.15 v124.21,89.15 | U9.53 124.06,26.02 v124.21,26.16
  Bottom 0.178: v124.21,26.16 v124.21,89.15
A_20  (via drill 0.38 pad 0.76)
  Top 0.178: J2.12 84.16,92.03 84.58,92.46 117.35,92.46 117.6,92.2 v117.6,91.95 | U9.55 114.72,27.02 115.32,26.42 116.84,26.42 v117.6,27.18
  Bottom 0.178: v117.6,27.18 v117.6,91.95
A_21  (via drill 0.38 pad 0.76)
  Top 0.178: J2.15 88.66,91.71 88.9,91.95 116.08,91.95 v116.59,91.44 | U9.56 116.25,27.52 v116.59,27.18
  Bottom 0.178: v116.59,27.18 v116.59,91.44
A_22  (via drill 0.38 pad 0.76)
  Top 0.178: v83.31,102.87 v119.13,102.87 | U9.57 118.95,28.02 v119.13,28.19
  Bottom 0.178: J2.2 83.16,102.72 v83.31,102.87 | v119.13,28.19 v119.13,102.87
A_23  (via drill 0.38 pad 0.76)
  Top 0.178: v81.79,103.89 v115.57,103.89 | U9.58 115.38,28.52 v115.57,28.7
  Bottom 0.178: J2.1 81.66,103.76 v81.79,103.89 | v115.57,28.7 v115.57,103.89
A_24  (via drill 0.38, 0.38 pad 0.76)
  Top 0.178: U9.10 81.13,20.98 v80.77,21.34 | v80.77,25.65 v93.98,25.65
  Bottom 0.178: J2.56 94.16,25.84 v93.98,25.65 | v80.77,21.34 v80.77,25.65
A_25  (via drill 0.38 pad 0.76)
  Top 0.178: U9.11 81.63,20.92 v82.04,21.34 | v82.04,24.89 92.2,24.89 v92.46,24.64
  Bottom 0.178: J2.55 92.66,25.61 92.46,25.4 v92.46,24.64 | v82.04,21.34 v82.04,24.89
BYTE#  (via drill 0.38)
  Top 0.178: U9.165 75.52,27.52 76.71,28.7 76.71,33.27 78.49,35.05 78.49,39.12 80.01,40.64 87.88,40.64 v89.66,42.42
  Bottom 0.178: v89.66,42.42 J2.53
CE_AIN  (via drill 0.38 pad 0.76)
  Top 0.178: R3.1 45.72,105.16 44.96,105.92 44.96,109.22 46.48,110.74 67.06,110.74 72.39,105.41 v72.39,98.55 | v86.11,72.39 v72.39,72.39
  Top 0.406: R3.1 47.08,102.45 47.5,102.87 U5.1
  Bottom 0.178: J2.32 86.16,72.33 v86.11,72.39 | v72.39,72.39 v72.39,98.55
CE_DAC  (via drill 0.38 pad 0.76)
  Top 0.178: U9.6 79.13,18.42 78.49,17.78 60.2,17.78 v59.69,18.29 | 48.5,106.93 U1.4 48.37,106.93 v46.23,106.93
  Bottom 0.178: v59.69,18.29 59.69,74.93 60.96,76.2 60.96,85.34 60.71,85.6 45.72,85.6 42.93,88.39 42.93,91.95 45.47,94.49 45.47,106.17 v46.23,106.93
DATA_A
  Top 0.178: J1.3 11.68,84.1 11.68,77.98 12.45,77.22 R5.1
  Top 0.406: U4.6 12.48,73.28 R5.1
DATA_B  (via drill 0.38 pad 0.76)
  Top 0.178: v12.45,68.33 R5.2
  Top 0.406: U4.7 14.61,72.01 13.97,71.37 12.61,71.37 R5.2
  Bottom 0.178: J1.4 13.97,83.38 13.97,69.6 12.7,68.33 v12.45,68.33
DET_RESET_AIN  (via drill 0.38 pad 0.76)
  Top 0.178: R8.1 58.17,94.74 58.67,94.23 78.49,94.23 v80.26,92.46
  Top 0.406: R8.1 57.06,95.67 56.64,95.25 U5.8
  Bottom 0.178: v80.26,92.46 86.36,92.46 87.12,91.69 87.12,90.47 J2.14
DET_RESET_DAC  (via drill 0.38 pad 0.76)
  Top 0.178: U9.7 79.63,21.21 v79.5,21.34 | v79.25,14.22 66.04,14.22 v65.79,14.48 | v65.28,87.12 62.23,87.12 58.17,91.19 55.77,91.19 U7.4
  Bottom 0.178: v79.5,21.34 79.5,14.48 v79.25,14.22 | v65.79,14.48 65.79,27.43 65.28,27.94 v65.28,87.12
DQ_00  (via drill 0.38 pad 0.76)
  Top 0.178: v90.68,66.04 72.9,66.04 v72.64,65.79 | v72.64,45.72 72.85,45.52 U9.132
  Bottom 0.178: J2.35 90.66,66.02 v90.68,66.04 | v72.64,65.79 v72.64,45.72
DQ_01  (via drill 0.38 pad 0.76)
  Top 0.178: J2.37 93.66,64.58 93.47,64.77 v71.37,64.77 | U9.131 77.13,44.61 76.96,44.45 71.37,44.45 v71.12,44.7
  Bottom 0.178: v71.12,44.7 71.12,64.52 v71.37,64.77
DQ_02  (via drill 0.38 pad 0.76)
  Top 0.178: U9.130 77.63,44.1 77.47,43.94 70.1,43.94 v69.85,44.2 | v69.85,61.98 v82.55,61.98
  Bottom 0.178: J2.39 82.66,61.87 v82.55,61.98 | v69.85,44.2 v69.85,61.98
DQ_03  (via drill 0.38 pad 0.76)
  Top 0.178: J2.41 85.66,60.9 85.6,60.96 v76.45,60.96 | U9.129 78.13,46.33 77.98,46.48 77.47,46.48 v76.45,47.5
  Bottom 0.178: v76.45,47.5 v76.45,60.96
DQ_04  (via drill 0.38 pad 0.76)
  Top 0.178: J2.44 90.16,58.92 89.92,58.67 78.99,58.67 78.49,59.18 v77.22,59.18 | U9.128 78.63,46.6 v77.72,47.5
  Bottom 0.178: v77.22,59.18 77.22,58.67 76.96,58.42 76.96,48.26 v77.72,47.5
DQ_05  (via drill 0.38 pad 0.76)
  Top 0.178: v78.74,48.26 78.74,47.24 79.13,46.86 U9.127
  Bottom 0.178: J2.46 93.16,59.12 92.46,58.42 80.77,58.42 78.74,56.39 v78.74,48.26
DQ_06  (via drill 0.38 pad 0.76)
  Top 0.178: J2.48 82.16,55.24 82.04,55.12 v79.5,55.12 | v79.5,47.5 79.63,47.37 U9.126
  Bottom 0.178: v79.5,55.12 v79.5,47.5
DQ_07  (via drill 0.38 pad 0.76)
  Top 0.178: v85.09,49.28 84.58,48.77 82.04,48.77 80.13,46.85 U9.125
  Bottom 0.178: J2.50 85.09,56.48 v85.09,49.28
DQ_08  (via drill 0.38 pad 0.76)
  Top 0.178: v92.2,66.04 v98.3,66.04 | U9.103 91.13,46.42 91.44,46.74 91.44,49.53 91.95,50.04 98.04,50.04 v98.3,50.29
  Bottom 0.178: J2.36 92.16,66 v92.2,66.04 | v98.3,50.29 v98.3,66.04
DQ_09  (via drill 0.38 pad 0.76)
  Top 0.178: J2.38 81.06,59.94 v75.44,59.94 | v75.69,53.09 v90.42,53.09 | v90.68,47.24 90.63,47.19 U9.104
  Bottom 0.178: v75.44,59.94 75.69,59.69 v75.69,53.09 | v90.42,53.09 90.68,52.83 v90.68,47.24
DQ_10  (via drill 0.38 pad 0.76)
  Top 0.178: v84.07,61.98 96.52,61.98 v97.03,61.47 | U9.105 90.13,46.53 89.92,46.74 89.92,47.75 90.68,48.51 90.68,49.78 91.44,50.55 96.77,50.55 v97.03,50.8
  Bottom 0.178: J2.40 84.16,61.81 v84.07,61.98 | v97.03,50.8 v97.03,61.47
DQ_11  (via drill 0.38 pad 0.76)
  Top 0.178: J2.42 87.16,61.25 87.38,61.47 94.74,61.47 v95.5,60.71 | v95.5,55.63 95.25,55.37 v85.85,55.37 | v84.84,47.75 84.13,47.04 U9.117
  Bottom 0.178: v95.5,60.71 v95.5,55.63 | v85.85,55.37 85.85,48.51 85.09,47.75 v84.84,47.75
DQ_12  (via drill 0.38 pad 0.76)
  Top 0.178: J2.45 91.66,58.39 91.44,58.17 v77.72,58.17 | v77.72,54.1 v82.8,54.1 | U9.118 83.63,47.44 83.06,48.01 v82.8,48.01
  Bottom 0.178: v77.72,58.17 v77.72,54.1 | v82.8,48.01 v82.8,54.1
DQ_13  (via drill 0.38)
  Top 0.178: U9.119 83.13,43.76 v82.8,43.43
  Bottom 0.178: J2.47 80.66,44.09 81.31,43.43 v82.8,43.43
DQ_14  (via drill 0.38)
  Top 0.178: U9.133 79.93,43.52 80.87,42.58 83.66,42.58 84.07,42.99 v84.07,43.18
  Bottom 0.178: J2.49 83.66,43.59 v84.07,43.18
DQ_15  (via drill 0.38)
  Top 0.178: U9.134 79.67,43.02 80.52,42.16 v86.61,42.16 86.66,42.16
  Bottom 0.178: J2.51 v86.61,42.16
FG  (via drill 0.38 pad 0.81)
  Top 0.813: v159.77,116.08 v159.77,109.98 v159.77,103.63 v159.77,97.28 v159.77,90.93 v159.77,84.58 v159.77,78.23 v159.77,71.88 v159.77,65.53 v159.77,59.18 v159.77,52.83 v159.77,46.48 v159.77,40.13 v159.77,33.78 v159.77,27.43 v159.77,21.08 v159.77,14.73 v159.77,8.38 v159.77,2.03 | v159.77,2.03 159.51,2.03 | 159.51,2.03 v153.42,2.03 v147.07,2.03 v140.72,2.03 v134.37,2.03 v128.02,2.03 v121.67,2.03 v115.32,2.03 v108.97,2.03 v102.62,2.03 v96.27,2.03 v89.92,2.03 v83.57,2.03 v77.22,2.03 v70.87,2.03 v64.52,2.03 v58.17,2.03 v51.82,2.03 v45.47,2.03 v39.12,2.03 v32.77,2.03 v26.42,2.03 v20.07,2.03 v13.72,2.03 v7.37,2.03 v1.52,2.03 | 159.51,2.29 159.51,2.03 | M1.1 v1.52,2.03 | v1.52,116.08 M3.1 | M2.1 v159.77,116.08 | M4.1 v159.77,2.03 | v159.77,116.08 v153.42,116.08 v147.07,116.08 v140.72,116.08 v134.37,116.08 v128.02,116.08 v121.67,116.08 v115.32,116.08 v108.97,116.08 v102.62,116.08 v96.27,116.08 v89.92,116.08 v83.57,116.08 v77.22,116.08 v70.87,116.08 v64.52,116.08 v58.17,116.08 v51.82,116.08 v45.47,116.08 v39.12,116.08 v32.77,116.08 v26.42,116.08 v20.07,116.08 v13.72,116.08 v7.37,116.08 v1.52,116.08 | v1.52,2.03 v1.52,7.87 v1.52,14.22 v1.52,20.57 v1.52,26.92 v1.52,33.27 v1.52,39.62 v1.52,45.97 v1.52,52.32 v1.52,58.67 v1.52,65.02 v1.52,71.37 v1.52,77.72 v1.52,84.07 v1.52,90.42 v1.52,96.77 v1.52,103.12 v1.52,109.47 v1.52,116.08
  Route2 0.813: v159.77,116.08 v159.77,109.98 v159.77,103.63 v159.77,97.28 v159.77,90.93 v159.77,84.58 v159.77,78.23 v159.77,71.88 v159.77,65.53 v159.77,59.18 v159.77,52.83 v159.77,46.48 v159.77,40.13 v159.77,33.78 v159.77,27.43 v159.77,21.08 v159.77,14.73 v159.77,8.38 v159.77,2.03 | v159.77,2.03 v153.42,2.03 v147.07,2.03 v140.72,2.03 v134.37,2.03 v128.02,2.03 v121.67,2.03 v115.32,2.03 v108.97,2.03 v102.62,2.03 v96.27,2.03 v89.92,2.03 v83.57,2.03 v77.22,2.03 v70.87,2.03 v64.52,2.03 v58.17,2.03 v51.82,2.03 v45.47,2.03 v39.12,2.03 v32.77,2.03 v26.42,2.03 v20.07,2.03 v13.72,2.03 v7.37,2.03 v1.52,2.03 | v1.52,2.03 v1.52,116.08 v159.77,116.08 | M1.1 v1.52,2.03 | 2.03,115.57 M3.1 | M2.1 v159.77,116.08 | M4.1 v159.77,2.03
  Route15 0.813: v1.52,116.08 v1.52,2.03 | v1.52,2.03 v7.37,2.03 v13.72,2.03 v20.07,2.03 v26.42,2.03 v32.77,2.03 v39.12,2.03 v45.47,2.03 v51.82,2.03 v58.17,2.03 v64.52,2.03 v70.87,2.03 v77.22,2.03 v83.57,2.03 v89.92,2.03 v96.27,2.03 v102.62,2.03 v108.97,2.03 v115.32,2.03 v121.67,2.03 v128.02,2.03 v134.37,2.03 v140.72,2.03 v147.07,2.03 v153.42,2.03 v159.77,2.03 | v159.77,2.03 v159.77,8.38 v159.77,14.73 v159.77,21.08 v159.77,27.43 v159.77,33.78 v159.77,40.13 v159.77,46.48 v159.77,52.83 v159.77,59.18 v159.77,65.53 v159.77,71.88 v159.77,78.23 v159.77,84.58 v159.77,90.93 v159.77,97.28 v159.77,103.63 v159.77,109.98 v159.77,116.08 | v159.77,116.08 v1.52,116.08 | M1.1 v1.52,2.03 | v1.52,116.08 M3.1 | M2.1 v159.77,116.08 | M4.1 v159.77,2.03
  Bottom 0.813: M1.1 v1.52,2.03 | v1.52,2.03 v7.37,2.03 v13.72,2.03 v20.07,2.03 v26.42,2.03 v32.77,2.03 v39.12,2.03 v45.47,2.03 v51.82,2.03 v58.17,2.03 v64.52,2.03 v70.87,2.03 v77.22,2.03 v83.57,2.03 v89.92,2.03 v96.27,2.03 v102.62,2.03 v108.97,2.03 v115.32,2.03 v121.67,2.03 v128.02,2.03 v134.37,2.03 v140.72,2.03 v147.07,2.03 v153.42,2.03 v159.77,2.03 | v159.77,2.03 v159.77,8.38 v159.77,14.73 v159.77,21.08 v159.77,27.43 v159.77,33.78 v159.77,40.13 v159.77,46.48 v159.77,52.83 v159.77,59.18 v159.77,65.53 v159.77,71.88 v159.77,78.23 v159.77,84.58 v159.77,90.93 v159.77,97.28 v159.77,103.63 v159.77,109.98 v159.77,116.08 | v159.77,116.08 v1.52,116.08 1.52,35.05 | 1.52,35.05 1.52,21.84 | 1.52,21.84 v1.52,2.03 | 2.03,115.57 M3.1 | v159.77,116.08 M2.1 | M4.1 v159.77,2.03 | J3.S2 1.55,35.03 1.52,35.05 | J3.S1 1.55,21.87 1.52,21.84
GND  (via drill 0.38, 0.38 pad 0.76, 0.51 pad 1.02)
  Top 0.178: U21.4 60.58,39.24 v60.71,39.37 | U9.139 72.51,40.52 v70.36,42.67 | U9.150 72.86,35.02 v72.64,34.8 72.64,33.78 72.91,33.52 U9.153 | U9.124 80.63,44.3 80.52,44.2 v79.76,44.2 | U9.111 87.13,43.94 v87.63,43.43 | U9.98 93.63,42.57 v93.47,42.42 | U9.83 98.17,41.02 v98.04,40.89 | U9.22 87.13,21.33 v86.87,21.59 | U9.156 70.12,32.02 v70.1,32 | U9.157 71.65,31.52 v71.12,30.99 | U9.35 93.63,19.05 | 93.63,19.05 93.63,18.39 v93.73,18.29 | R13.1 v44.45,41.15 | v90.17,21.34 90.13,21.29 U9.28 U9.29 U9.30 | U9.33 92.63,19.13 92.71,19.05 93.63,19.05 | U9.170 69.98,25.02 v69.85,25.15 | U9.66 99.06,32.52 98.81,32.26 98.81,31.24 99.03,31.02 U9.63 100.15,30.99 103.63,30.99 v103.89,31.24 | R12.1 112.27,30.73 v112.52,30.99 | U9.60 98.25,29.52 v98.04,29.72 | C25.1 61.72,27.69 61.47,27.94 61.47,28.7 61.72,28.96 C30.1 | U9.45 101.68,22.02 v101.85,21.84 | C21.1 82.21,50.89 v81.79,51.31
  Top 0.406: U6.4 9.14,61.47 | 9.14,61.47 v9.14,57.91 | 9.14,61.47 9.14,62.23 | v9.14,65.02 9.14,62.23 | 9.14,62.23 10.41,62.23 | 10.41,62.23 v10.41,65.02 10.41,66.04 10.92,66.55 C8.2 | 10.41,62.23 v10.41,57.91 | C20.1 v11.68,44.7 | Y1.2 90.61,12.01 v90.68,11.94 | C15.2 v24.13,66.55 | v48.77,93.73 U2.2 | v51.82,92.2 U7.2 | v42.67,95.5 44.03,95.5 R2.2 | v44.2,103.89 R1.2 | v52.32,105.92 U1.2 | R7.2 59.86,102.62 v61.21,102.62 | v61.21,95.76 59.78,95.76 R6.2 | U8.2 54.86,104.39 55.37,103.89 v55.88,103.89
  Top 0.61: U5.11 v56.64,99.06 63.75,99.06
  Route2 0.178: v60.71,39.37 60.96,39.62 | v72.64,34.8 72.39,34.54
  Route2 0.406: J2.33 87.63,63.18 87.63,65.53 | J2.52 88.14,56.52 88.14,55.12
  Bottom 0.178: v70.36,42.67 70.36,42.93 | v79.76,44.2 79.5,44.45 | v87.63,43.43 87.88,43.18 | v93.47,42.42 93.47,41.91 | v98.04,40.89 97.79,40.64 | v70.1,32 69.85,32 | v71.12,30.99 70.87,30.99 | v44.45,41.15 44.7,41.15 | v90.17,21.34 90.42,21.59 | v103.89,31.24 104.14,31.24 | v112.52,30.99 112.78,30.99 | v98.04,29.72 98.04,29.97 | C27.1 v95.5,34.8
  Bottom 0.406: C6.- 17.27,40.64 22.1,35.81 22.1,32.77 21.34,32 19.4,32 J3.4 | v11.68,44.7 12.45,43.94 14.22,43.94 15.24,44.96 C6.- | C6.- 19.05,44.96 | v90.68,11.94 90.93,11.68 | v56.39,88.9 C13.1 | C32.1 91.44,38.1 v90.17,36.83
  other vias: 57.15,49.78 57.15,48.26 57.15,46.74 57.15,45.21 57.15,65.02 57.15,62.48 57.15,59.94 57.15,57.4 44.45,62.48 45.72,59.94 44.45,57.4 45.72,54.86 44.45,52.32 38.1,82.8 40.64,84.07 43.18,82.8 45.72,84.07 48.26,82.8 50.8,84.07 53.34,82.8 25.4,7.87 27.94,9.14 30.48,7.87 33.02,9.14 35.56,7.87 35.56,10.41 30.48,10.41 25.4,10.41 44.45,10.41 44.45,7.87 46.99,9.14 49.53,7.87 49.53,10.41 52.07,9.14 54.61,7.87 54.61,10.41 49.78,22.1 51.56,22.1 53.34,22.1 50.55,20.83 52.58,20.83 49.53,19.56 51.56,19.56 53.34,19.56 49.28,29.21 50.8,29.21 108.2,16.76 108.2,15.24 108.2,13.72 108.2,12.19 110.74,12.19 110.74,13.72 110.74,15.24 110.74,16.76 109.47,16 109.47,14.48 109.47,12.95 111.76,18.54 111.76,21.59 111.76,20.07 113.03,19.3 113.03,20.83 94.23,15.24 81.79,50.04 133.35,28.19 133.35,26.16 13.97,107.7 15.49,107.7 16.76,106.68 12.7,106.68 22.86,99.82 23.88,99.82 21.84,98.55 24.89,98.55 10.92,90.68 12.19,90.68 39.62,108.71 40.64,108.71 41.66,107.44 38.61,107.44 45.47,89.15 48.01,109.22 58.17,108.46 30.99,97.28 33.53,94.49 29.46,90.42 34.8,96.01 32.26,98.55 37.08,97.28 37.08,100.08 33.02,90.42 17.02,88.9 17.02,85.6 10.67,81.53 14.99,81.53 14.99,80.01 10.67,80.01 10.67,78.49 11.18,76.71 11.18,75.18 12.95,80.26 12.95,78.74 21.08,78.99 21.08,77.47 144.27,61.21 68.33,103.63 70.61,101.6 68.33,99.31 70.61,96.77 64.77,96.77 64.77,101.35 68.58,91.69 70.61,89.92 68.58,88.39 74.93,110.49 77.47,107.95 80.01,110.49 82.55,107.95 85.09,110.49 87.63,107.95 90.17,110.49 92.71,107.95 95.25,110.49 97.79,107.95 101.6,110.49 105.41,107.95 109.22,110.49 113.03,107.95 148.59,111.76 148.59,105.41 154.94,105.41 151.13,52.07 151.13,20.32 151.13,34.29 151.13,38.1 154.94,12.7 148.59,12.7 148.59,6.35 83.82,36.83 83.82,29.21 90.17,29.21 102.87,85.09 99.06,82.55 123.19,10.16 130.81,10.16 138.43,10.16 130.81,33.02 133.35,63.5 133.35,74.93 133.35,87.63 133.35,99.06 99.31,10.16 104.39,11.94
  pour Top (isolate 0.762): 3.81,107.44 10.16,107.44 10.16,114.3 151.13,114.3 151.13,107.95 157.48,107.95 157.48,10.16 151.13,10.16 151.13,3.81 10.16,3.81 10.16,10.16 3.81,10.16 3.81,55.12 38.1,55.12 38.1,68.58 3.81,68.58 3.81,77.22 3.81,107.19
  pour Bottom (isolate 0.762): 3.81,107.44 10.16,107.44 10.16,114.3 151.13,114.3 151.13,107.95 157.48,107.95 157.48,10.16 151.13,10.16 151.13,3.81 10.16,3.81 10.16,10.16 3.81,10.16 3.81,19.05 15.24,19.05 15.24,38.1 3.81,38.1 3.81,39.37
  pour Route2 (isolate 0.762): 3.81,114.3 157.48,114.3 157.48,3.81 3.81,3.81
IO_RS485_RXD  (via drill 0.38)
  Top 0.178: U9.43 97.63,21.93 v97.79,22.1 | v95,52.32 91.44,52.32 91.19,52.07 89.92,52.07 89.66,52.32 v49.02,52.32 | v48.77,71.63 48.26,72.14 26.67,72.14 25.27,70.74 U4.1
  Bottom 0.178: v97.79,22.1 97.79,28.19 96.77,29.21 96.77,42.42 95.25,43.94 95.25,52.07 v95,52.32 | v49.02,52.32 48.77,52.58 v48.77,71.63
IO_RS485_TE_RE  (via drill 0.38)
  Top 0.178: 25.65,73.28 U4.3 | U4.2 23.05,71.88 25.15,71.88 25.65,72.39 25.65,73.28 | 25.65,73.28 54.48,73.28 arc-90 54.61,73.15 v69.85,73.15 | U9.147 72.7,36.52 v72.39,36.83
  Bottom 0.178: v72.39,36.83 72.39,38.35 69.09,41.66 69.09,72.39 v69.85,73.15
IO_RS485_TXD  (via drill 0.38 pad 0.76)
  Top 0.178: v64.52,13.46 84.33,13.46 84.58,13.21 v96.27,13.21 | v96.52,21.59 97.13,20.98 U9.42 | U4.4 64.39,74.55 v64.52,74.68
  Bottom 0.178: v64.52,74.68 v64.52,13.46 | v96.52,21.59 96.52,15.24 96.77,14.99 96.77,14.48 96.52,14.22 96.52,13.46 v96.27,13.21
N$1
  Top 0.178: U9.65 102.62,32.02 | 102.62,32.02 105.14,32.02 106.43,30.73 R12.2 | U9.64 102.6,31.52 102.62,31.5 102.62,32.02
N$2
  Top 0.178: U9.68 112.79,33.52 113.14,33.17 R17.6
N$3
  Top 0.178: U9.69 118.48,34.02 R17.5
N$4  (via drill 0.38, 0.38 pad 0.76)
  Top 0.178: U9.19 85.63,18.77 v85.85,18.54 | C17.2 100.08,15.49 98.55,13.97 v97.54,13.97 | v90.93,9.91 v93.47,9.91
  Bottom 0.178: v85.85,18.54 85.85,10.41 86.36,9.91 v90.93,9.91 | v97.54,13.97 97.03,13.46 97.03,10.16 96.77,9.91 v93.47,9.91
N$5  (via drill 0.38 pad 0.76, 0.51 pad 1.02)
  Top 0.178: U9.62 105.12,30.52 v105.41,30.23 | v105.41,10.16 C18.2
  Bottom 0.178: v105.41,30.23 v105.41,10.16
N$6  (via drill 0.38 pad 0.76)
  Top 0.178: U9.148 72.08,36.02 68.58,32.51 v66.8,32.51 C19.2
N$7
  Top 0.178: C21.2 87.88,48.01 86.63,46.75 U9.112
N$8  (via drill 0.38 pad 0.76)
  Top 0.178: Y1.3 v88.14,15.75 | v88.14,21.59 U9.24
  Bottom 0.178: v88.14,15.75 v88.14,21.59
N$9
  Top 0.406: U1.1 51.24,104.97 51.31,104.9 51.31,100.84 50.8,100.33 U5.3
N$10
  Top 0.406: U7.1 52.83,93.33 52.83,97.28 53.34,97.79 U5.10
N$11  (via drill 0.38 pad 0.76)
  Top 0.406: v40.89,49.28 32.51,49.28 U10.8 U10.7 U10.6 | PF1.1 v22.35,11.43 20.57,11.43 19.81,10.67 17.18,10.67 C24.2
  Bottom 0.406: v40.89,49.28 v40.89,4.83 23.37,4.83 21.84,6.35 21.84,10.92 v22.35,11.43
N$12
  Top 0.406: J3.1 21.53,24.95 22.35,24.13 PF1.2 24.48,19.72 25.91,18.29 R18.1
  Bottom 0.406: J3.1 22.8,24.95 25.4,22.35 30.48,22.35 31.5,23.37 C28.+
N$13
  Top 0.406: J3.2 27.07,27.45 R14.2 R16.2 27.09,23.96 D3.2
N$14  (via drill 0.38 pad 0.76, 0.51 pad 1.02)
  Top 0.178: U9.27 89.63,19.09 90.17,18.54 90.17,17.53 90.68,17.02 97.79,17.02 v98.3,16.51 | R10.1 98.55,11.94 v98.3,12.19
  Bottom 0.178: v98.3,16.51 v98.3,12.19
N$15
  Top 0.406: J3.3 24.15,29.45 24.38,29.21 R15.2 R19.2 27.09,32.09 26.67,32.51 D4.2
N$16
  Top 0.406: R3.2 46.9,100.75 47.75,101.6 U5.2
  Top 0.813: R1.1 R3.2
N$17
  Top 0.406: U2.1 49.72,92.9 51.31,94.49 51.31,97.28 50.8,97.79 U5.5
N$18
  Top 0.406: R8.2 57.49,97.37 56.64,96.52 U5.9
  Top 0.813: R8.2 R6.1
N$19
  Top 0.406: R4.1 46.9,97.37 47.75,96.52 U5.6
  Top 0.813: R2.1 R4.1
N$20
  Top 0.406: U8.1 53.91,104.46 52.83,103.38 52.83,100.84 53.34,100.33 U5.12
N$21
  Top 0.406: U5.13 56.39,101.6 57.24,100.75 R9.2
  Top 0.813: R7.1 R9.2
N$22
  Top 1.016: U3.1 31.24,54.1 32.51,52.83 C3.1
  Bottom 1.016: D2.C D1.C 14.75,97.03 C2.+ 28.7,97.03 31.24,94.49 U3.1
N$23  (via drill 0.38 pad 0.76)
  Top 0.178: v52.32,23.62 52.43,23.52 U9.173
  Bottom 0.178: TP3.1 48.01,74.17 52.32,69.85 v52.32,23.62
N$24  (via drill 0.38 pad 0.76)
  Top 0.178: U9.172 54.22,24.02 v53.59,24.64
  Bottom 0.178: v53.59,24.64 53.59,71.12 51.31,73.41 TP4.1
N$25  (via drill 0.38 pad 0.76)
  Top 0.178: v42.42,13.46 62.99,13.46 64.01,12.45 80.52,12.45 v80.77,12.19 | v81.28,17.78 82.13,18.63 U9.12
  Bottom 0.178: TP1.1 41.4,50.29 41.91,49.78 41.91,13.97 v42.42,13.46 | v80.77,12.19 80.77,17.27 v81.28,17.78
N$26  (via drill 0.38 pad 0.76)
  Top 0.178: v42.67,15.24 42.93,15.49 78.99,15.49 79.76,14.73 v81.79,14.73 | v84.07,21.59 83.31,21.59 82.63,20.9 U9.13
  Bottom 0.178: TP2.1 44.7,68.07 42.16,65.53 42.16,50.55 42.67,50.04 v42.67,15.24 | v81.79,14.73 82.04,14.99 82.04,17.53 84.07,19.56 v84.07,21.59
OE#  (via drill 0.38 pad 0.76)
  Top 0.178: v89.15,68.83 49.02,68.83 v47.75,67.56 | U9.8 80.13,17.64 79.76,17.27 48.26,17.27 v47.75,17.78
  Bottom 0.178: J2.34 89.16,68.83 v89.15,68.83 | v47.75,17.78 v47.75,67.56 47.88,67.69
QSPI_CS  (via drill 0.38)
  Top 0.178: U9.141 76.09,39.52 v76.2,39.62 | v75.69,49.02 66.8,49.02 v66.55,48.77 | v66.29,35.56 66.17,35.43 U21.1
  Bottom 0.178: v76.2,39.62 76.2,46.23 75.44,46.99 75.44,48.77 v75.69,49.02 | v66.55,48.77 66.55,35.81 v66.29,35.56
QSPI_D0
  Top 0.178: U21.5 50.26,40.36 51.05,41.15 69.6,41.15 71.73,39.02 U9.142
QSPI_D1  (via drill 0.51 pad 1.02)
  Top 0.178: U21.2 69.22,36.7 v69.34,36.83 | v69.6,38.86 71.12,38.86 71.47,38.52 U9.143
  Bottom 0.178: v69.34,36.83 69.34,38.61 v69.6,38.86
QSPI_D2
  Top 0.178: U21.3 74.58,37.97 U9.144
QSPI_D3
  Top 0.178: U21.7 46.35,36.7 45.47,35.81 45.47,34.8 46.23,34.04 68.33,34.04 71.81,37.52 U9.145
QSPI_SCK
  Top 0.178: U21.6 48.64,37.97 48.01,38.61 48.01,41.4 48.51,41.91 69.6,41.91 71.49,40.02 U9.140
RESET#
  Top 0.178: U9.67 112.53,33.02 113.18,32.37 115.06,32.37 | R17.7 115.06,32.37 | 135.32,29.97 115.57,29.97 115.06,30.48 115.06,32.37 | J4.15 144.27,29.97 143.26,30.99 139.19,30.99 138.18,29.97 135.38,29.97 135.32,29.97 | U11.1 135.32,29.97
RY/BY#  (via drill 0.38 pad 0.76)
  Top 0.178: J2.17 91.66,91.15 91.95,91.44 95.76,91.44 v96.27,90.93 | v96.27,96.77 v74.17,96.77 | v76.96,26.42 76.06,25.52 U9.169
  Bottom 0.178: v96.27,90.93 v96.27,96.77 | v74.17,96.77 73.66,96.27 73.66,26.92 74.17,26.42 v76.96,26.42
SCLK  (via drill 0.38 pad 0.76)
  Top 0.178: U9.167 63.85,26.52 v63.75,26.42 | U7.5 v56.9,92.2 60.45,92.2 v63.75,88.9 | U2.5 v48.77,88.65 | U8.5 v54.86,109.22 | U1.5 v47.24,105.92
  Bottom 0.178: v63.75,26.42 v63.75,88.9 | v54.86,109.22 54.86,104.9 | 54.86,104.9 54.86,95.5 56.9,93.47 v56.9,92.2 56.13,91.44 52.07,91.44 49.28,88.65 v48.77,88.65 | v47.24,105.92 49.28,105.92 50.29,104.9 54.86,104.9
SPARE_AIN
  Top 0.406: U5.14 56.39,102.87 56.81,102.45 R9.1 58.17,103.38 58.67,103.89 61.47,103.89 SPARE_AIN.1
SPARE_DAC  (via drill 0.38 pad 0.76)
  Top 0.178: U9.44 101.65,20.02 v102.11,19.56 | v102.11,7.62 59.69,7.62 v58.42,8.89 | v58.42,84.07 v66.8,84.07 | v66.8,95.5 66.8,106.68 64.01,109.47 57.26,109.47 U8.4
  Bottom 0.178: v102.11,19.56 v102.11,7.62 | v58.42,8.89 58.42,75.18 57.4,76.2 57.4,83.06 v58.42,84.07 | v66.8,84.07 v66.8,95.5
SYNC  (via drill 0.38 pad 0.76)
  Top 0.178: U9.168 65.64,26.02 64.52,24.89 62.74,24.89 v61.98,25.65 | v58.17,93.22 55.77,93.22 U7.6 54.54,93.15 v54.36,92.96 | v49.78,91.19 49.72,91.12 U2.6 | U8.6 53.42,108.03 53.09,107.7 53.09,104.65 52.07,103.63 v52.07,99.06 | U1.6 47.56,104.97 v46.99,104.39
  Bottom 0.178: v61.98,25.65 61.98,89.41 v58.17,93.22 | v54.36,92.96 52.07,92.96 | 52.07,92.96 51.31,92.96 49.78,91.44 v49.78,91.19 | 52.07,92.96 v52.07,99.06 51.31,99.06 50.55,99.82 48.26,99.82 46.99,101.09 v46.99,104.39
TCK_SWCLK  (via drill 0.38 pad 0.76)
  Top 0.178: U9.88 102.7,43.52 v102.87,43.69 | v103.12,36.58 109.98,36.58 110.49,36.07 v118.36,36.07 126.75,36.07 127.25,36.58 v137.16,36.58 | v118.36,45.97 116.74,45.97 R20.1
  Bottom 0.178: v102.87,43.69 102.87,36.83 v103.12,36.58 | v118.36,36.07 v118.36,45.97 | v137.16,36.58 138.43,36.58 140.46,38.61 143.76,38.61 144.27,38.1 J4.9
TDI
  Top 0.178: U9.91 97.13,47.09 97.28,47.24 102.62,47.24 102.87,46.99 109.22,46.99 110.74,48.51 110.74,50.04 111.25,50.55 115.82,50.55 116.59,49.78 116.59,48.53 R20.4 132.15,48.44 136.91,43.69 143,43.69 arc-90 J4.5
TDO  (via drill 0.38 pad 0.76)
  Top 0.178: U9.90 97.63,46.57 97.79,46.74 102.36,46.74 102.62,46.48 109.22,46.48 v109.73,45.97 | v109.98,41.4 v123.44,41.4 124.21,41.4 124.71,41.91 127.51,41.91 127.76,41.66 137.92,41.66 138.68,40.89 138.68,34.29 139.45,33.53 143.26,33.53 144.27,32.51 J4.13 | v123.44,47.24 123.04,47.64 R20.3
  Bottom 0.178: v109.73,45.97 109.73,41.66 v109.98,41.4 | v123.44,41.4 v123.44,47.24
TMS_SWDIO  (via drill 0.38 pad 0.76)
  Top 0.178: U9.89 108.41,45.52 v108.71,45.21 | v108.71,43.18 v124.97,43.18 | R20.2 122.57,46.84 122.94,46.48 v124.97,46.48 133.35,46.48 136.65,43.18 138.18,43.18 140.21,41.15 144.02,41.15 144.27,40.89 J4.7
  Bottom 0.178: v108.71,45.21 v108.71,43.18 | v124.97,43.18 v124.97,46.48
USB_DM  (via drill 0.38)
  Top 0.178: R14.1 v60.71,27.43 | v61.47,21.34 77.98,21.34 80.52,23.88 90.42,23.88 91.63,22.67 U9.31
  Bottom 0.178: v60.71,27.43 60.71,22.1 v61.47,21.34
USB_DP  (via drill 0.38)
  Top 0.178: U9.32 92.13,18.29 v92.2,18.29 | v91.95,5.84 39.62,5.84 v39.12,6.35 | v39.12,29.21 R15.1
  Bottom 0.178: v92.2,18.29 92.2,5.84 v91.95,5.84 | v39.12,6.35 v39.12,29.21
USB_OVER_CRNT  (via drill 0.51 pad 1.02)
  Top 0.305: R13.2 v33.53,41.15 | v33.78,30.73 v56.64,30.73 | v56.64,11.18 82.55,11.18 v82.8,11.43 | v83.06,17.27 83.63,17.84 U9.15
  Top 0.813: R13.2 R11.2 34.8,44.11 34.8,45.21 34.42,45.59 U10.5
  Bottom 0.305: v33.53,41.15 33.53,30.99 v33.78,30.73 | v56.64,30.73 v56.64,11.18 | v82.8,11.43 82.8,17.02 v83.06,17.27
USB_VBUS_EN  (via drill 0.51 pad 1.02)
  Top 0.178: U10.4 26.29,45.59 26.42,45.72
  Top 0.305: 26.42,45.72 26.16,45.47 23.37,45.47 21.08,43.18 21.08,40.39 21.84,39.62 42.93,39.62 v44.96,37.59 | U9.16 84.13,16.76 84.07,16.76 83.57,16.26 47.75,16.26 v45.21,18.8
  Bottom 0.305: v45.21,18.8 44.96,19.05 v44.96,37.59
VCC  (via drill 0.38, 0.38 pad 0.76, 0.51 pad 1.02)
  Top 0.178: U9.110 v87.63,46.74 | U9.123 81.13,46.84 v81.53,47.24 | v76.96,35.31 76.75,35.52 U9.149 72.35,35.52 67.56,30.73 v66.8,30.73 C26.2 | U9.25 88.63,20.05 88.65,20.07 88.65,20.83 89.15,21.34 89.15,22.1 v89.66,22.61 | U9.84 98.44,41.52 97.79,42.16 v97.79,42.42 | C30.2 v66.8,28.96 70.61,28.96 72.67,31.02 U9.158 74.65,30.99 75.69,30.99 75.95,31.24 75.95,32.26 75.69,32.52 U9.155 | v15.24,78.23 16,78.99 C31.2 | v90.93,18.54 90.93,17.78 91.19,17.53 99.31,17.53 99.57,17.27 C10.1 | U9.61 103.59,30.02 104.39,29.21 113.28,29.21 113.54,29.46 126.75,29.46 127.51,28.7 v127.51,27.43 128.02,26.92 C33.2 | U9.154 v72.39,33.02 | v72.9,27.69 C25.2 | U9.171 76.07,24.52 v76.45,24.13 | v75.69,19.81 C34.2 | U9.97 94.13,44.05 95,43.18 95,42.42 v95.25,42.16 | U9.34 93.13,21.5 v93.73,22.1 | C35.2 99.31,13.72 98.81,13.21 97.79,13.21 96.77,12.19 v95.25,12.19 | C11.1 90.59,16.34 89.92,17.02 v89.41,17.02 | v89.41,17.02 v87.12,17.02 86.11,17.02 85.6,16.51 Y1.4 | U9.26 89.13,18.32 89.41,18.03 v89.41,17.02
  Top 0.305: U9.138 77.09,41.02 v77.22,40.89 | U9.48 102.47,23.52 103.38,22.61 108.46,22.61 | 108.46,22.61 v110.24,22.61 | C9.1 108.46,22.61
  Top 0.406: R17.2 123.3,32.37 123.44,32.51 123.44,33.27 | 123.44,33.27 123.44,33.78 | 123.44,33.78 123.44,34.54 124.21,35.31 v127.25,35.31 | R17.4 123.26,33.97 123.44,33.78 | R17.3 123.34,33.17 123.44,33.27 | R20.5 112.45,48.44 112.27,48.26 112.27,47.5 | 112.27,47.5 112.27,46.74 | 112.27,46.74 112.27,45.72 | 112.27,45.72 112.27,44.45 v112.52,44.2 | R20.6 112.41,47.64 112.27,47.5 | R20.7 112.38,46.84 112.27,46.74 | R20.8 112.59,46.04 112.27,45.72 | R11.1 37.85,43.09 v37.85,44.45 | U21.8 46.86,35.43 v46.74,35.56 | U4.8 16.13,70.74 v15.49,70.1 | U11.2 133.25,23.62 128.52,23.62 127.76,22.86 C16.1 126.15,21.42 v125.98,21.59 | U2.3 47.64,92.71 v46.74,92.71 | v52.83,90.17 52.83,91.08 U7.3 | v91.44,41.91 92.2,41.15 94.23,41.15 v95.25,42.16
  Top 0.61: v144.27,54.36 C23.2 | v51.31,107.95 51.31,107.04 U1.3 | v56.9,105.16 55.99,105.16 U8.3
  Top 0.813: v18.03,66.55 17.78,66.55 | 17.78,66.55 17.78,64.01 17.45,63.68 U6.3 | 16.76,66.55 16.76,63.75 | C8.1 v16.51,66.55 | 16.76,66.55 17.78,66.55 | 16.76,66.55 v16.51,66.55 | v16.51,66.55 16.51,65.79 | C15.1 v18.03,66.55 | v18.03,66.55 18.03,65.79 | v16.51,66.55 16.51,66.8 18.03,66.8 | R11.1 v46.74,42.93 | C31.2 C12.1
  Route15 0.178: v81.53,47.24 82.04,47.24
  Route15 0.305: v77.22,40.89 77.22,40.13
  Route15 0.406: v127.25,35.31 128.02,35.31
  Route15 0.61: J2.29 81.66,64.39 81.53,64.52 | 80.26,58.17 78.74,56.64
  Route15 0.813: J2.43 88.66,58.18 88.65,58.17 | 88.65,58.17 96.77,58.17 | 88.65,58.17 80.26,58.17 79.5,58.17
  Bottom 0.178: v87.63,46.74 88.16,47.27 | v97.79,42.42 97.79,42.67 | v15.24,78.23 15.24,70.36 v15.49,70.1 | v89.66,22.61 90.93,22.61 91.19,22.35 91.19,18.8 v90.93,18.54 | v72.39,33.02 72.9,32.51 v72.9,27.69 | v76.45,24.13 76.45,20.57 v75.69,19.81 | v93.73,22.1 93.73,20.57 95.25,19.05 v95.25,12.19 | v95.25,42.16 95.5,41.91 C27.2
  Bottom 0.406: C5.2 46.57,92.29 46.74,92.46 v46.74,92.71 | C13.2 53.25,90 53.09,90.17 v52.83,90.17 | v76.96,35.31 C29.2 | C32.2 v91.44,41.91
  Bottom 0.61: J4.1 v144.27,54.36 | C4.2 51.31,109.05 v51.31,107.95 | C14.2 58,105.16 v56.9,105.16
  Bottom 0.813: v46.74,42.93 v46.74,35.56
  pour Route15 (isolate 0.762): 3.81,114.3 157.48,114.3 157.48,3.81 3.81,3.81
WE#  (via drill 0.38 pad 0.76)
  Top 0.178: J2.13 85.66,91.63 v85.6,91.69 | v76.96,27.94 76.04,27.02 U9.166
  Bottom 0.178: v85.6,91.69 75.69,91.69 74.63,90.63 74.63,27.78 74.97,27.43 76.45,27.43 v76.96,27.94
WP_ACC_AIN  (via drill 0.38 pad 0.76)
  Top 0.178: v75.69,87.63 72.14,87.63 69.85,85.34 54.61,85.34 53.34,86.61 v50.55,86.61 | v46.48,86.87 45.97,86.87 43.69,89.15 43.69,92.46 45.72,94.49 R4.2
  Top 0.406: R4.2 47.33,95.67 47.75,95.25 U5.7
  Bottom 0.178: J2.16 90.16,89.14 89.92,88.9 76.96,88.9 v75.69,87.63 | v50.55,86.61 46.74,86.61 v46.48,86.87
WP_ACC_DAC  (via drill 0.38 pad 0.76)
  Top 0.178: v72.14,18.54 72.39,18.29 77.98,18.29 78.63,18.94 U9.5 | v68.07,82.8 55.37,82.8 52.32,85.85 49.78,85.85 47.75,87.88 47.75,89.77 U2.4
  Bottom 0.178: v68.07,82.8 68.07,35.05 72.14,30.99 v72.14,18.54

## Text on the board
tNames: CE | ANALOG | 24V | DET RESET | WP/ACC | DETECTOR | COMMS | 31813 Rev A | (C) 2020 HighPoint Design LLC | POWER | USB | MCU
bNames: 24V IN | DETECTOR | PROGRAMMING